# Altium project YUsendQB50.PrjPCB
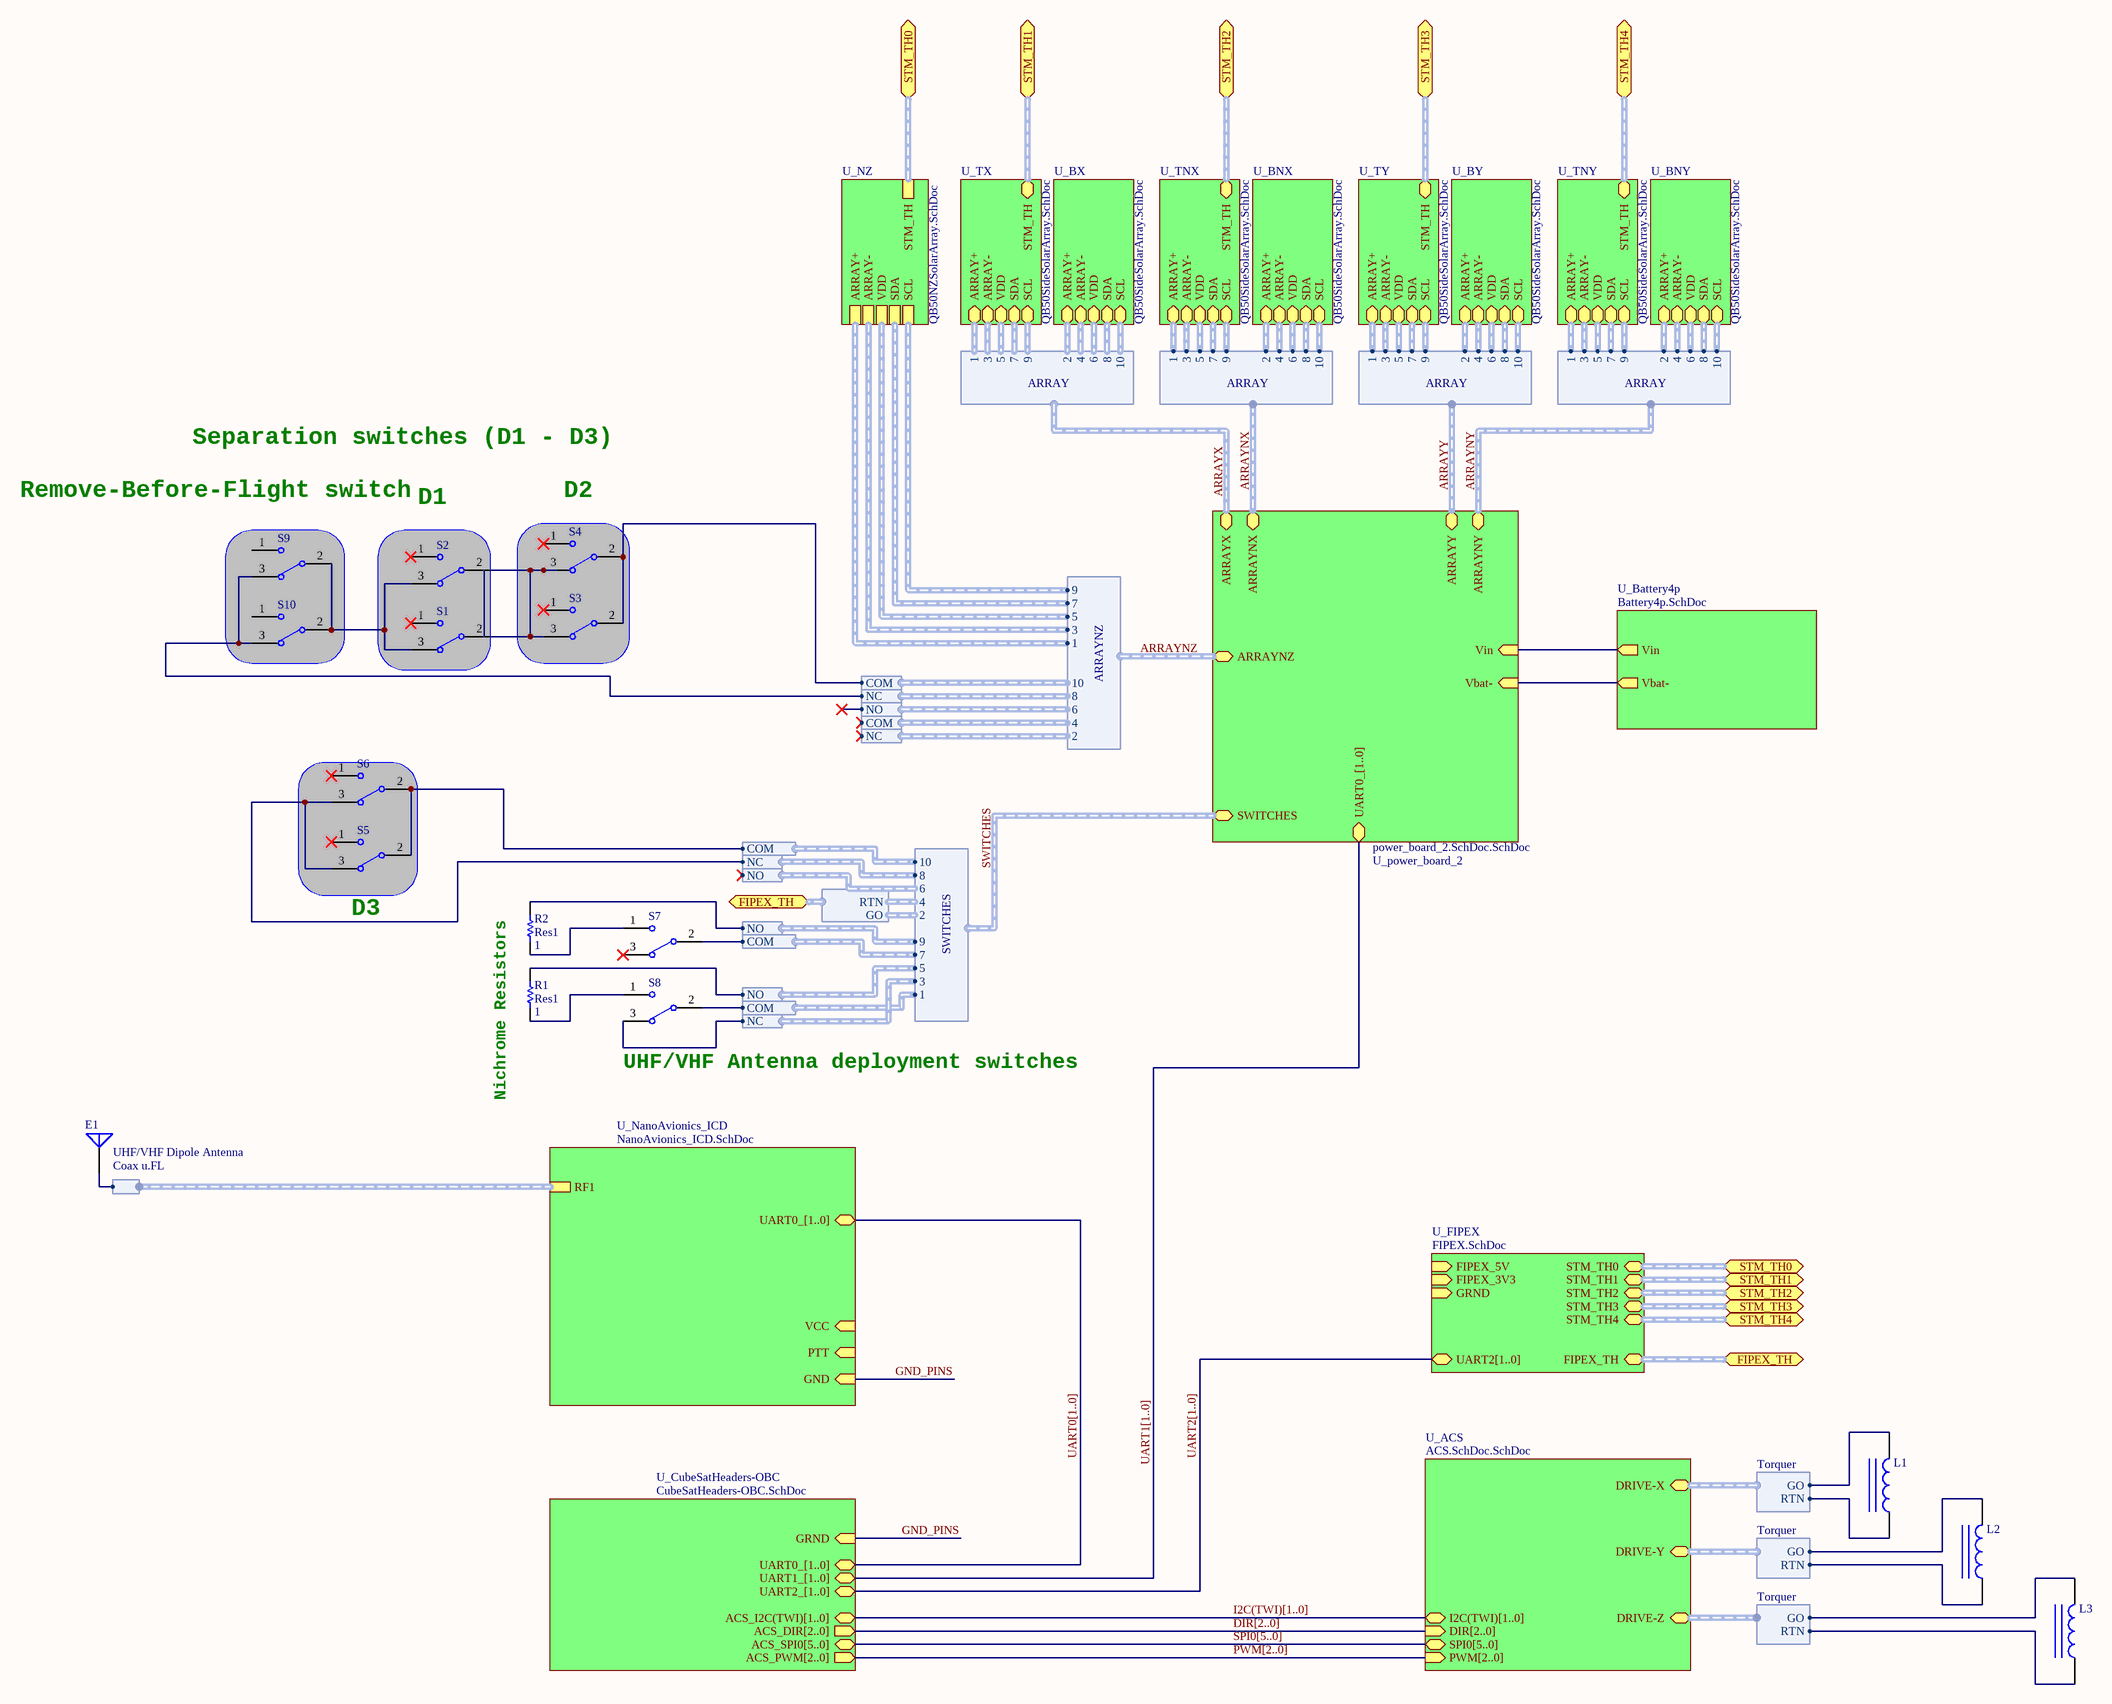
[diagram p0: YUsendQB50-TopLevel.SchDoc]
8 sheets, 320 parts. Net scope: hierarchical (ports join the sheet entries above them; power ports are global).
Sheets:
  YUsendQB50-TopLevel.SchDoc
    U_CubeSatHeaders-OBC = CubeSatHeaders-OBC.SchDoc
    U_power_board_2 = power_board_2.SchDoc.SchDoc
    U_ACS = ACS.SchDoc.SchDoc
    U_FIPEX = FIPEX.SchDoc
    U_TX = QB50SideSolarArray.SchDoc
    U_BX = QB50SideSolarArray.SchDoc
    U_TNX = QB50SideSolarArray.SchDoc
    U_BNX = QB50SideSolarArray.SchDoc
    U_TY = QB50SideSolarArray.SchDoc
    U_BY = QB50SideSolarArray.SchDoc
    U_TNY = QB50SideSolarArray.SchDoc
    U_BNY = QB50SideSolarArray.SchDoc
    U_NZ = QB50NZSolarArray.SchDoc
    U_NanoAvionics_ICD = NanoAvionics_ICD.SchDoc

## Sheet YUsendQB50-TopLevel.SchDoc: Top Level YUsend-QB50 (CA01)
size C; DrawnBy: H. Chesser

### Parts
(Parts that share a designator on the sheet are numbered #1, #2 ... from top to bottom, then left to right.)
E1  UHF/VHF Dipole Antenna  [PIN1]
L1#1  Inductor Iron  [AXIAL-0.9]  (value not drawn)
L2#1  Inductor Iron  [AXIAL-0.9]  (value not drawn)
L3#1  Inductor Iron  [AXIAL-0.9]  (value not drawn)
R1#1  Res1  value 1  [AXIAL-0.3]
R2#1  Res1  value 1  [AXIAL-0.3]
S1  SW-SPDT  [TL36WW15050]  (value not drawn)
S2  SW-SPDT  [TL36WW15050]  (value not drawn)
S3  SW-SPDT  [TL36WW15050]  (value not drawn)
S4  SW-SPDT  [TL36WW15050]  (value not drawn)
S5  SW-SPDT  [TL36WW15050]  (value not drawn)
S6  SW-SPDT  [TL36WW15050]  (value not drawn)
S7  SW-SPDT  [TL36WW15050]  (value not drawn)
S8  SW-SPDT  [TL36WW15050]  (value not drawn)
S9  SW-SPDT  [TL36WW15050]  (value not drawn)
S10  SW-SPDT  [TL36WW15050]  (value not drawn)

### Sub-sheets
U_ACS = ACS.SchDoc.SchDoc: I2C(TWI)[1..0] (bidir), PWM[2..0] (in), DRIVE-X (harness Torquer), DRIVE-Y (harness Torquer), DRIVE-Z (harness Torquer), DIR[2..0] (in), SPI0[5..0] (bidir)
U_Battery4p = Battery4p.SchDoc (file not in this document): Vbat- (out), Vin (out)
U_BNX = QB50SideSolarArray.SchDoc: ARRAY+ (harness ARRAY+), ARRAY- (harness ARRAY-), VDD (harness VDD), SDA (harness SDA), SCL (harness SCL)
U_BNY = QB50SideSolarArray.SchDoc: ARRAY+ (harness ARRAY+), ARRAY- (harness ARRAY-), VDD (harness VDD), SDA (harness SDA), SCL (harness SCL)
U_BX = QB50SideSolarArray.SchDoc: ARRAY+ (harness ARRAY+), ARRAY- (harness ARRAY-), VDD (harness VDD), SDA (harness SDA), SCL (harness SCL)
U_BY = QB50SideSolarArray.SchDoc: ARRAY+ (harness ARRAY+), ARRAY- (harness ARRAY-), VDD (harness VDD), SDA (harness SDA), SCL (harness SCL)
U_CubeSatHeaders-OBC = CubeSatHeaders-OBC.SchDoc: UART0_[1..0] (bidir), UART1_[1..0] (bidir), GRND (in), UART2_[1..0] (bidir), ACS_I2C(TWI)[1..0] (bidir), ACS_DIR[2..0] (out), ACS_PWM[2..0] (out), ACS_SPI0[5..0] (bidir)
U_FIPEX = FIPEX.SchDoc: UART2[1..0] (bidir), GRND (in), FIPEX_3V3 (in), FIPEX_5V (in), STM_TH0 (harness STM_TH), STM_TH2 (harness STM_TH), STM_TH3 (harness STM_TH), STM_TH4 (harness STM_TH), FIPEX_TH (harness STM_TH), STM_TH1 (harness STM_TH)
U_NanoAvionics_ICD = NanoAvionics_ICD.SchDoc: UART0_[1..0] (bidir), VCC (in), RF1 (harness Coax u.FL), PTT (in), GND (in)
U_NZ = QB50NZSolarArray.SchDoc: ARRAY+ (harness ARRAY+), ARRAY- (harness ARRAY-), VDD (harness VDD), SDA (harness SDA), SCL (harness SCL), STM_TH (harness STM_TH)
U_power_board_2 = power_board_2.SchDoc.SchDoc: UART0_[1..0] (bidir), ARRAYX (harness ARRAY), ARRAYNX (harness ARRAY), ARRAYY (harness ARRAY), ARRAYNY (harness ARRAY), ARRAYNZ (harness ARRAYNZ), SWITCHES (harness SWITCHES), Vin (in), Vbat- (in)
U_TNX = QB50SideSolarArray.SchDoc: ARRAY+ (harness ARRAY+), ARRAY- (harness ARRAY-), VDD (harness VDD), SDA (harness SDA), SCL (harness SCL), STM_TH (harness STM_TH)
U_TNY = QB50SideSolarArray.SchDoc: ARRAY+ (harness ARRAY+), ARRAY- (harness ARRAY-), VDD (harness VDD), SDA (harness SDA), SCL (harness SCL), STM_TH (harness STM_TH)
U_TX = QB50SideSolarArray.SchDoc: ARRAY+ (harness ARRAY+), ARRAY- (harness ARRAY-), VDD (harness VDD), SDA (harness SDA), SCL (harness SCL), STM_TH (harness STM_TH)
U_TY = QB50SideSolarArray.SchDoc: ARRAY+ (harness ARRAY+), ARRAY- (harness ARRAY-), VDD (harness VDD), SDA (harness SDA), SCL (harness SCL), STM_TH (harness STM_TH)

### Ports
FIPEX_TH, FIPEX_TH (harness STM_TH), STM_TH0, STM_TH1, STM_TH2, STM_TH3, STM_TH4

### Harnesses
ARRAY: 1, 3, 5, 7, 9, 2, 4, 6, 8, 10
ARRAY: 1, 10, 2, 3, 4, 5, 6, 7, 8, 9
ARRAYNZ: 1, 10, 2, 3, 4, 5, 6, 7, 8, 9
SEPCOM: COM
SEPNC: NC
COM: COM
NC: NC
NO: NO
SWITCHES: 1, 10, 2, 3, 4, 5, 6, 7, 8, 9
STM_TH: GO, RTN
Torquer: GO, RTN
Coax u.FL: 

### Nets
GND_PINS: R1#1.2 R2#1.2 ; sheet U_CubeSatHeaders-OBC/GRND, sheet U_NanoAvionics_ICD/GND, harness NO.NO  [project net Array-]
ARRAYNZ.8.NC.NC: S9.3 S10.3 ; sheet U_power_board_2/Vin, sheet U_Battery4p/Vin, harness SEPNC.NC
ARRAYNZ.10.COM.COM: S3.2 S4.2 ; harness SEPCOM.COM
DRIVE-XA: L1#1.2 ; sheet U_ACS/DRIVE-X.GO
DRIVE-XB: L1#1.1 ; sheet U_ACS/DRIVE-X.RTN
DRIVE-YA: L2#1.2 ; sheet U_ACS/DRIVE-Y.GO
DRIVE-YB: L2#1.1 ; sheet U_ACS/DRIVE-Y.RTN
DRIVE-ZA: L3#1.2 ; sheet U_ACS/DRIVE-Z.GO
DRIVE-ZB: L3#1.1 ; sheet U_ACS/DRIVE-Z.RTN
SWITCHES.1.COM.COM: S8.2 ; harness COM.COM
SWITCHES.3.NC.NC: S7.2 S8.3 ; harness COM.COM, harness NC.NC
SWITCHES.10.COM.COM: sheet U_power_board_2/Vbat-, sheet U_Battery4p/Vbat-
NetE1_1: E1.1(A) ; sheet U_NanoAvionics_ICD/RF1.
NetR1#1_1: R1#1.1 S8.1
NetR2#1_1: R2#1.1 S7.1
NetS1_2: S1.2 S2.2 S3.3 S4.3
NetS1_3: S1.3 S2.3 S9.2 S10.2
NetS5_2: S5.2 S6.2 ; harness COM.COM
NetS5_3: S5.3 S6.3 ; harness NC.NC

Not connected (* = marked no-connect by the designer): S1 1*; S2 1*; S3 1*; S4 1*; S5 1*; S6 1*; S7 3*; S9 1; S10 1

### Buses and harness runs
bus DIR[2..0] = sheet U_ACS/DIR[2..0] = sheet U_CubeSatHeaders-OBC/ACS_DIR[2..0]
bus I2C(TWI)[1..0] = sheet U_ACS/I2C(TWI)[1..0] = sheet U_CubeSatHeaders-OBC/ACS_I2C(TWI)[1..0]
bus PWM[2..0] = sheet U_ACS/PWM[2..0] = sheet U_CubeSatHeaders-OBC/ACS_PWM[2..0]
bus SPI0[5..0] = sheet U_ACS/SPI0[5..0] = sheet U_CubeSatHeaders-OBC/ACS_SPI0[5..0]
bus UART0[1..0] = sheet U_CubeSatHeaders-OBC/UART0_[1..0] = sheet U_NanoAvionics_ICD/UART0_[1..0]
bus UART1[1..0] = sheet U_CubeSatHeaders-OBC/UART1_[1..0] = sheet U_power_board_2/UART0_[1..0]
bus UART2[1..0] = sheet U_CubeSatHeaders-OBC/UART2_[1..0] = sheet U_FIPEX/UART2[1..0]
harness ARRAYNX = sheet U_power_board_2/ARRAYNX
harness ARRAYNY = sheet U_power_board_2/ARRAYNY
harness ARRAYNZ = sheet U_power_board_2/ARRAYNZ
harness ARRAYX = sheet U_power_board_2/ARRAYX
harness ARRAYY = sheet U_power_board_2/ARRAYY
harness port FIPEX_TH = sheet U_FIPEX/FIPEX_TH
harness port STM_TH0 = sheet U_FIPEX/STM_TH0
harness port STM_TH0 = sheet U_NZ/STM_TH
harness port STM_TH1 = sheet U_FIPEX/STM_TH1
harness port STM_TH1 = sheet U_TX/STM_TH
harness port STM_TH2 = sheet U_FIPEX/STM_TH2
harness port STM_TH2 = sheet U_TNX/STM_TH
harness port STM_TH3 = sheet U_FIPEX/STM_TH3
harness port STM_TH3 = sheet U_TY/STM_TH
harness port STM_TH4 = sheet U_FIPEX/STM_TH4
harness port STM_TH4 = sheet U_TNY/STM_TH
harness SWITCHES = sheet U_power_board_2/SWITCHES

### Notes on the sheet
- Separation switches (D1 - D3)
- (near S9) Remove-Before-Flight switch
- (near S2) D1
- (near S4) D2
- (near S5) D3
- Nichrome Resistors
- (near S8) UHF/VHF Antenna deployment switches

### Library data of the parts
E1 = Antenna: Generic Antenna; Published: 24-Mar-1999; LatestRevisionDate: 17-Jul-2002; LatestRevisionNote: Re-released for DXP Platform.; PackageReference: PIN1; Publisher: Altium Limited
L1#1 L2#1 L3#1 = Inductor Iron: Magnetic-Core Inductor; Value: 10mH; Published: 24-Mar-1999; LatestRevisionDate: 17-Jul-2002; LatestRevisionNote: Re-released for DXP Platform.; PackageReference: AXIAL-0.9; Publisher: Altium Limited; PackageDescription: Axial Device, Thru-Hole; 2 Leads; 0.9 in Pin Spacing
R1#1 R2#1 = Res1: Resistor; Published: 8-Jun-2000; LatestRevisionDate: 17-Jul-2002; LatestRevisionNote: Re-released for DXP Platform.; PackageReference: AXIAL-0.3; Publisher: Altium Limited; PackageDescription: Axial Device, Thru-Hole; 2 Leads; 0.3 in Pin Spacing
S1-S10 = SW-SPDT: SPDT Subminiature Toggle Switch, Right Angle Mounting, Vertical Actuation; Published: 24-Mar-1999; LatestRevisionDate: 17-Dec-2003; LatestRevisionNote: Schematic revised, PCB Footprint replaced.; DatasheetVersion: 05-Dec-2000; PackageReference: TL36WW15050; Publisher: Altium Limited; PackageDescription: Switch; 4 Leads; ComponentLink1Description: Manufacturer Link; ComponentLink1URL: http://www.apem.com; Supplier 1: Digi-Key; Supplier Part Number 1: 255-3400-ND

## Sheet CubeSatHeaders-OBC.SchDoc
size A4
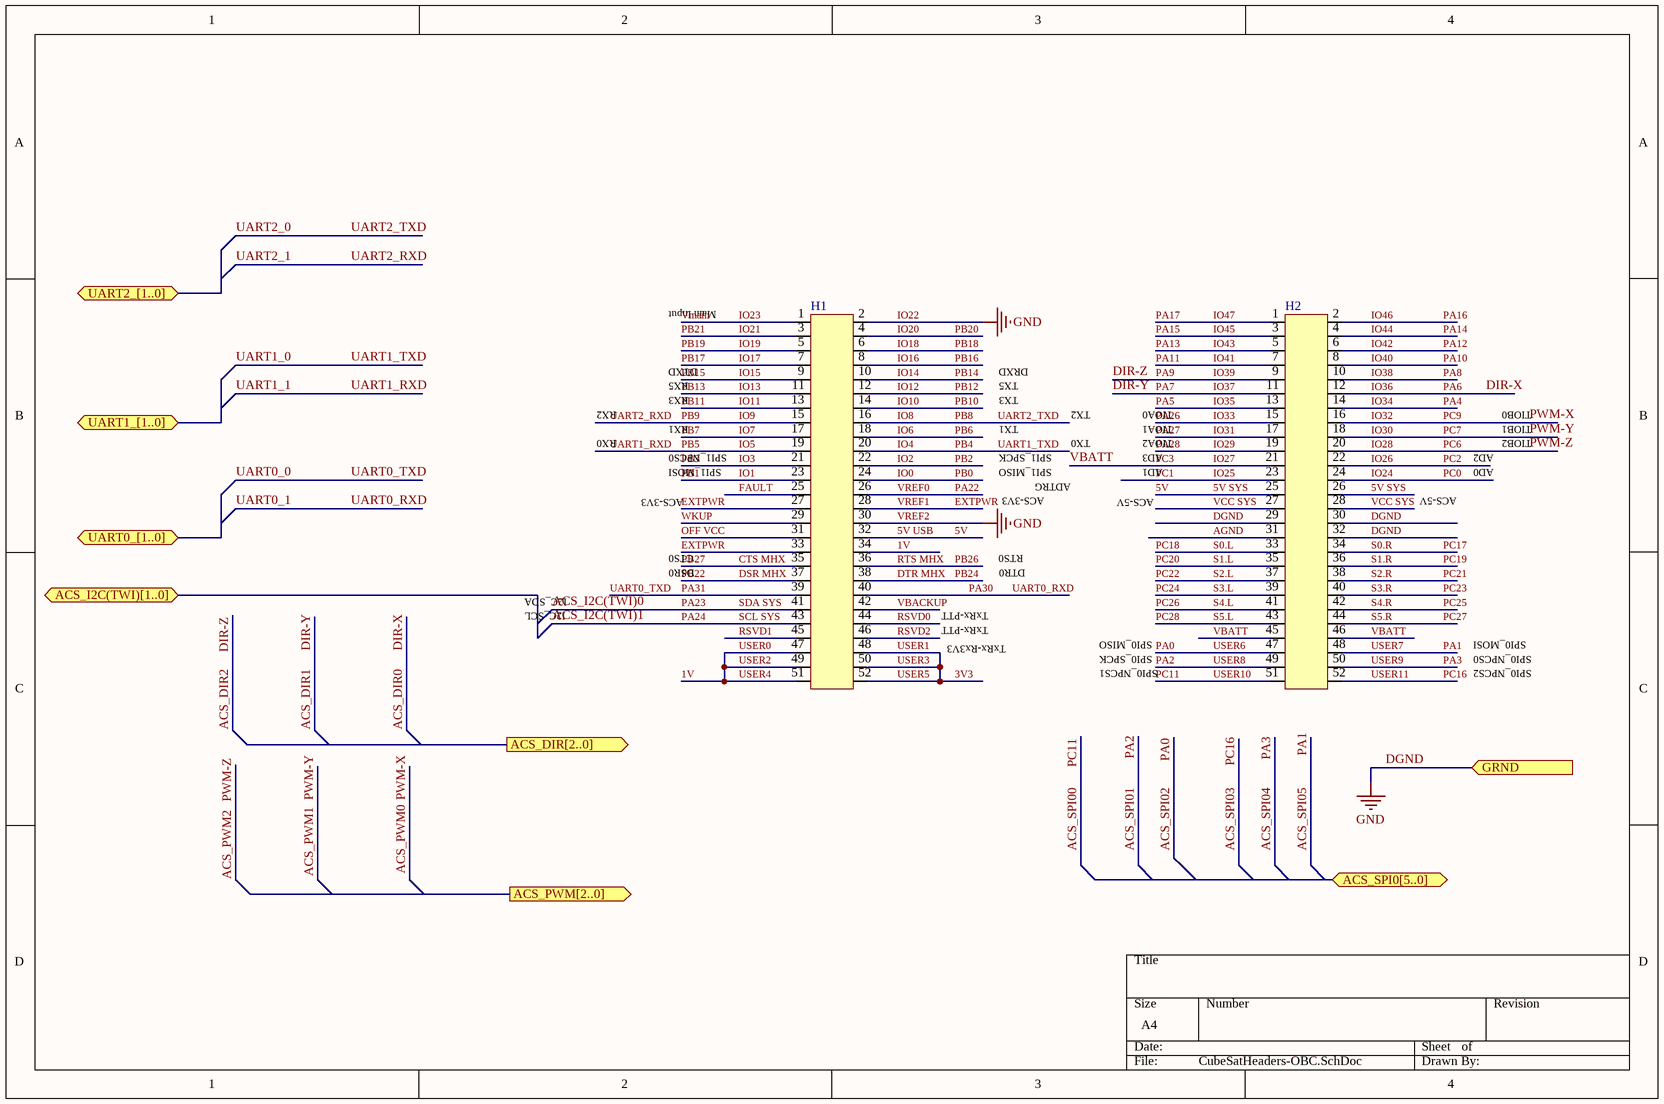
[diagram p1: CubeSatHeaders-OBC.SchDoc]

### Parts
(Parts that share a designator on the sheet are numbered #1, #2 ... from top to bottom, then left to right.)
H1#1  H?  [SAMTEC_ESQ_126_39_G_D]  (value not drawn)
H2#1  H?  [SAMTEC_ESQ_126_39_G_D]  (value not drawn)

### Ports
ACS_DIR[2..0] (out), ACS_I2C(TWI)[1..0] (bidir), ACS_PWM[2..0] (out), ACS_SPI0[5..0] (bidir), GRND (in), UART0_[1..0] (bidir), UART1_[1..0] (bidir), UART2_[1..0] (bidir)

### Nets
DGND: H1#1.2 H1#1.30 H2#1.29 H2#1.30 H2#1.32 ; port GRND  [also labelled GND, IO22, VREF2]  [project net Array-]
1V: H1#1.34 H1#1.47 H1#1.49 H1#1.51  [also labelled USER0, USER2, USER4]
3V3: H1#1.48 H1#1.50 H1#1.52  [also labelled USER1, USER3, USER5]
5V: H1#1.32 H2#1.25 H2#1.26  [also labelled 5V SYS, 5V USB]
ACS_DIR0: H2#1.12  [also labelled DIR-X, IO36, PA6]
ACS_DIR1: H2#1.11  [also labelled DIR-Y, IO37, PA7]
ACS_DIR2: H2#1.9  [also labelled DIR-Z, IO39, PA9]
ACS_I2C(TWI)0: H1#1.41  [also labelled PA23, SDA SYS]
ACS_I2C(TWI)1: H1#1.43  [also labelled PA24, SCL SYS]
ACS_PWM0: H2#1.16  [also labelled IO32, PC9, PWM-X]
ACS_PWM1: H2#1.18  [also labelled IO30, PC7, PWM-Y]
ACS_PWM2: H2#1.20  [also labelled IO28, PC6, PWM-Z]
ACS_SPI00: H2#1.51  [also labelled PC11, USER10]
ACS_SPI01: H2#1.49  [also labelled PA2, USER8]
ACS_SPI02: H2#1.47  [also labelled PA0, USER6]
ACS_SPI03: H2#1.52  [also labelled PC16, USER11]
ACS_SPI04: H2#1.50  [also labelled PA3, USER9]
ACS_SPI05: H2#1.48  [also labelled PA1, USER7]
AGND: H2#1.31
CTS MHX: H1#1.35  [also labelled PB27]
DSR MHX: H1#1.37  [also labelled PB22]
DTR MHX: H1#1.38  [also labelled PB24]
EXTPWR: H1#1.27 H1#1.28 H1#1.33  [also labelled VREF1]
FAULT: H1#1.25
IO0: H1#1.24  [also labelled PB0]
IO1: H1#1.23  [also labelled PB1]
IO2: H1#1.22  [also labelled PB2]
IO3: H1#1.21  [also labelled PB3]
IO4: H1#1.20  [also labelled PB4, UART1_0, UART1_TXD]
IO5: H1#1.19  [also labelled PB5, UART1_1, UART1_RXD]
IO6: H1#1.18  [also labelled PB6]
IO7: H1#1.17  [also labelled PB7]
IO8: H1#1.16  [also labelled PB8, UART2_0, UART2_TXD]
IO9: H1#1.15  [also labelled PB9, UART2_1, UART2_RXD]
IO10: H1#1.14  [also labelled PB10]
IO11: H1#1.13  [also labelled PB11]
IO12: H1#1.12  [also labelled PB12]
IO13: H1#1.11  [also labelled PB13]
IO14: H1#1.10  [also labelled PB14]
IO15: H1#1.9  [also labelled PB15]
IO16: H1#1.8  [also labelled PB16]
IO17: H1#1.7  [also labelled PB17]
IO18: H1#1.6  [also labelled PB18]
IO19: H1#1.5  [also labelled PB19]
IO20: H1#1.4  [also labelled PB20]
IO21: H1#1.3  [also labelled PB21]
IO23: H1#1.1  [also labelled Vmain]
IO24: H2#1.24  [also labelled PC0]
IO25: H2#1.23  [also labelled PC1]
IO26: H2#1.22  [also labelled PC2]
IO27: H2#1.21 H2#1.45 H2#1.46  [also labelled PC3, VBATT]
IO29: H2#1.19  [also labelled PA28]
IO31: H2#1.17  [also labelled PA27]
IO33: H2#1.15  [also labelled PA26]
IO34: H2#1.14  [also labelled PA4]
IO35: H2#1.13  [also labelled PA5]
IO38: H2#1.10  [also labelled PA8]
IO40: H2#1.8  [also labelled PA10]
IO41: H2#1.7  [also labelled PA11]
IO42: H2#1.6  [also labelled PA12]
IO43: H2#1.5  [also labelled PA13]
IO44: H2#1.4  [also labelled PA14]
IO45: H2#1.3  [also labelled PA15]
IO46: H2#1.2  [also labelled PA16]
IO47: H2#1.1  [also labelled PA17]
OFF VCC: H1#1.31
PA22: H1#1.26  [also labelled VREF0]
PA30: H1#1.40  [also labelled UART0_1, UART0_RXD]
PA31: H1#1.39  [also labelled UART0_0, UART0_TXD]
PB26: H1#1.36  [also labelled RTS MHX]
PC17: H2#1.34  [also labelled S0.R]
PC18: H2#1.33  [also labelled S0.L]
PC19: H2#1.36  [also labelled S1.R]
PC20: H2#1.35  [also labelled S1.L]
PC21: H2#1.38  [also labelled S2.R]
PC22: H2#1.37  [also labelled S2.L]
PC23: H2#1.40  [also labelled S3.R]
PC24: H2#1.39  [also labelled S3.L]
PC25: H2#1.42  [also labelled S4.R]
PC26: H2#1.41  [also labelled S4.L]
PC27: H2#1.44  [also labelled S5.R]
PC28: H2#1.43  [also labelled S5.L]
RSVD0: H1#1.44
RSVD1: H1#1.45
RSVD2: H1#1.46
VBACKUP: H1#1.42
VCC SYS: H2#1.27 H2#1.28
WKUP: H1#1.29

### Notes on the sheet
- Main Input
- RX3
- RX5
- DTXD
- TX3
- TX5
- DRXD
- RX0
- RX2
- RX1
- SPI1_NPCS0
- SPI1_MOSI
- TX1
- SPI1_SPCK
- SPI1_MISO
- TX0
- TX2
- AD1
- AD3
- TIOA0
- TIOA1
- TIOA2
- AD0
- AD2
- TIOB0
- TIOB1
- TIOB2
- ACS-3V3
- ADTRG
- ACS-5V
- I2C_SDA
- I2C_SCL
- CTS0
- DSR0
- TxRx-PTT
- DTR0
- RTS0
- TxRx-Rx3V3
- SPI0_MISO
- SPI0_SPCK
- SPI0_NPCS1
- SPI0_MOSI
- SPI0_NPCS0
- SPI0_NPCS2

### Library data of the parts
H1#1 H2#1 = SAMTEC_ESQ_126_39_G_D: 26X2 header

## Sheet power_board_2.SchDoc.SchDoc
size C
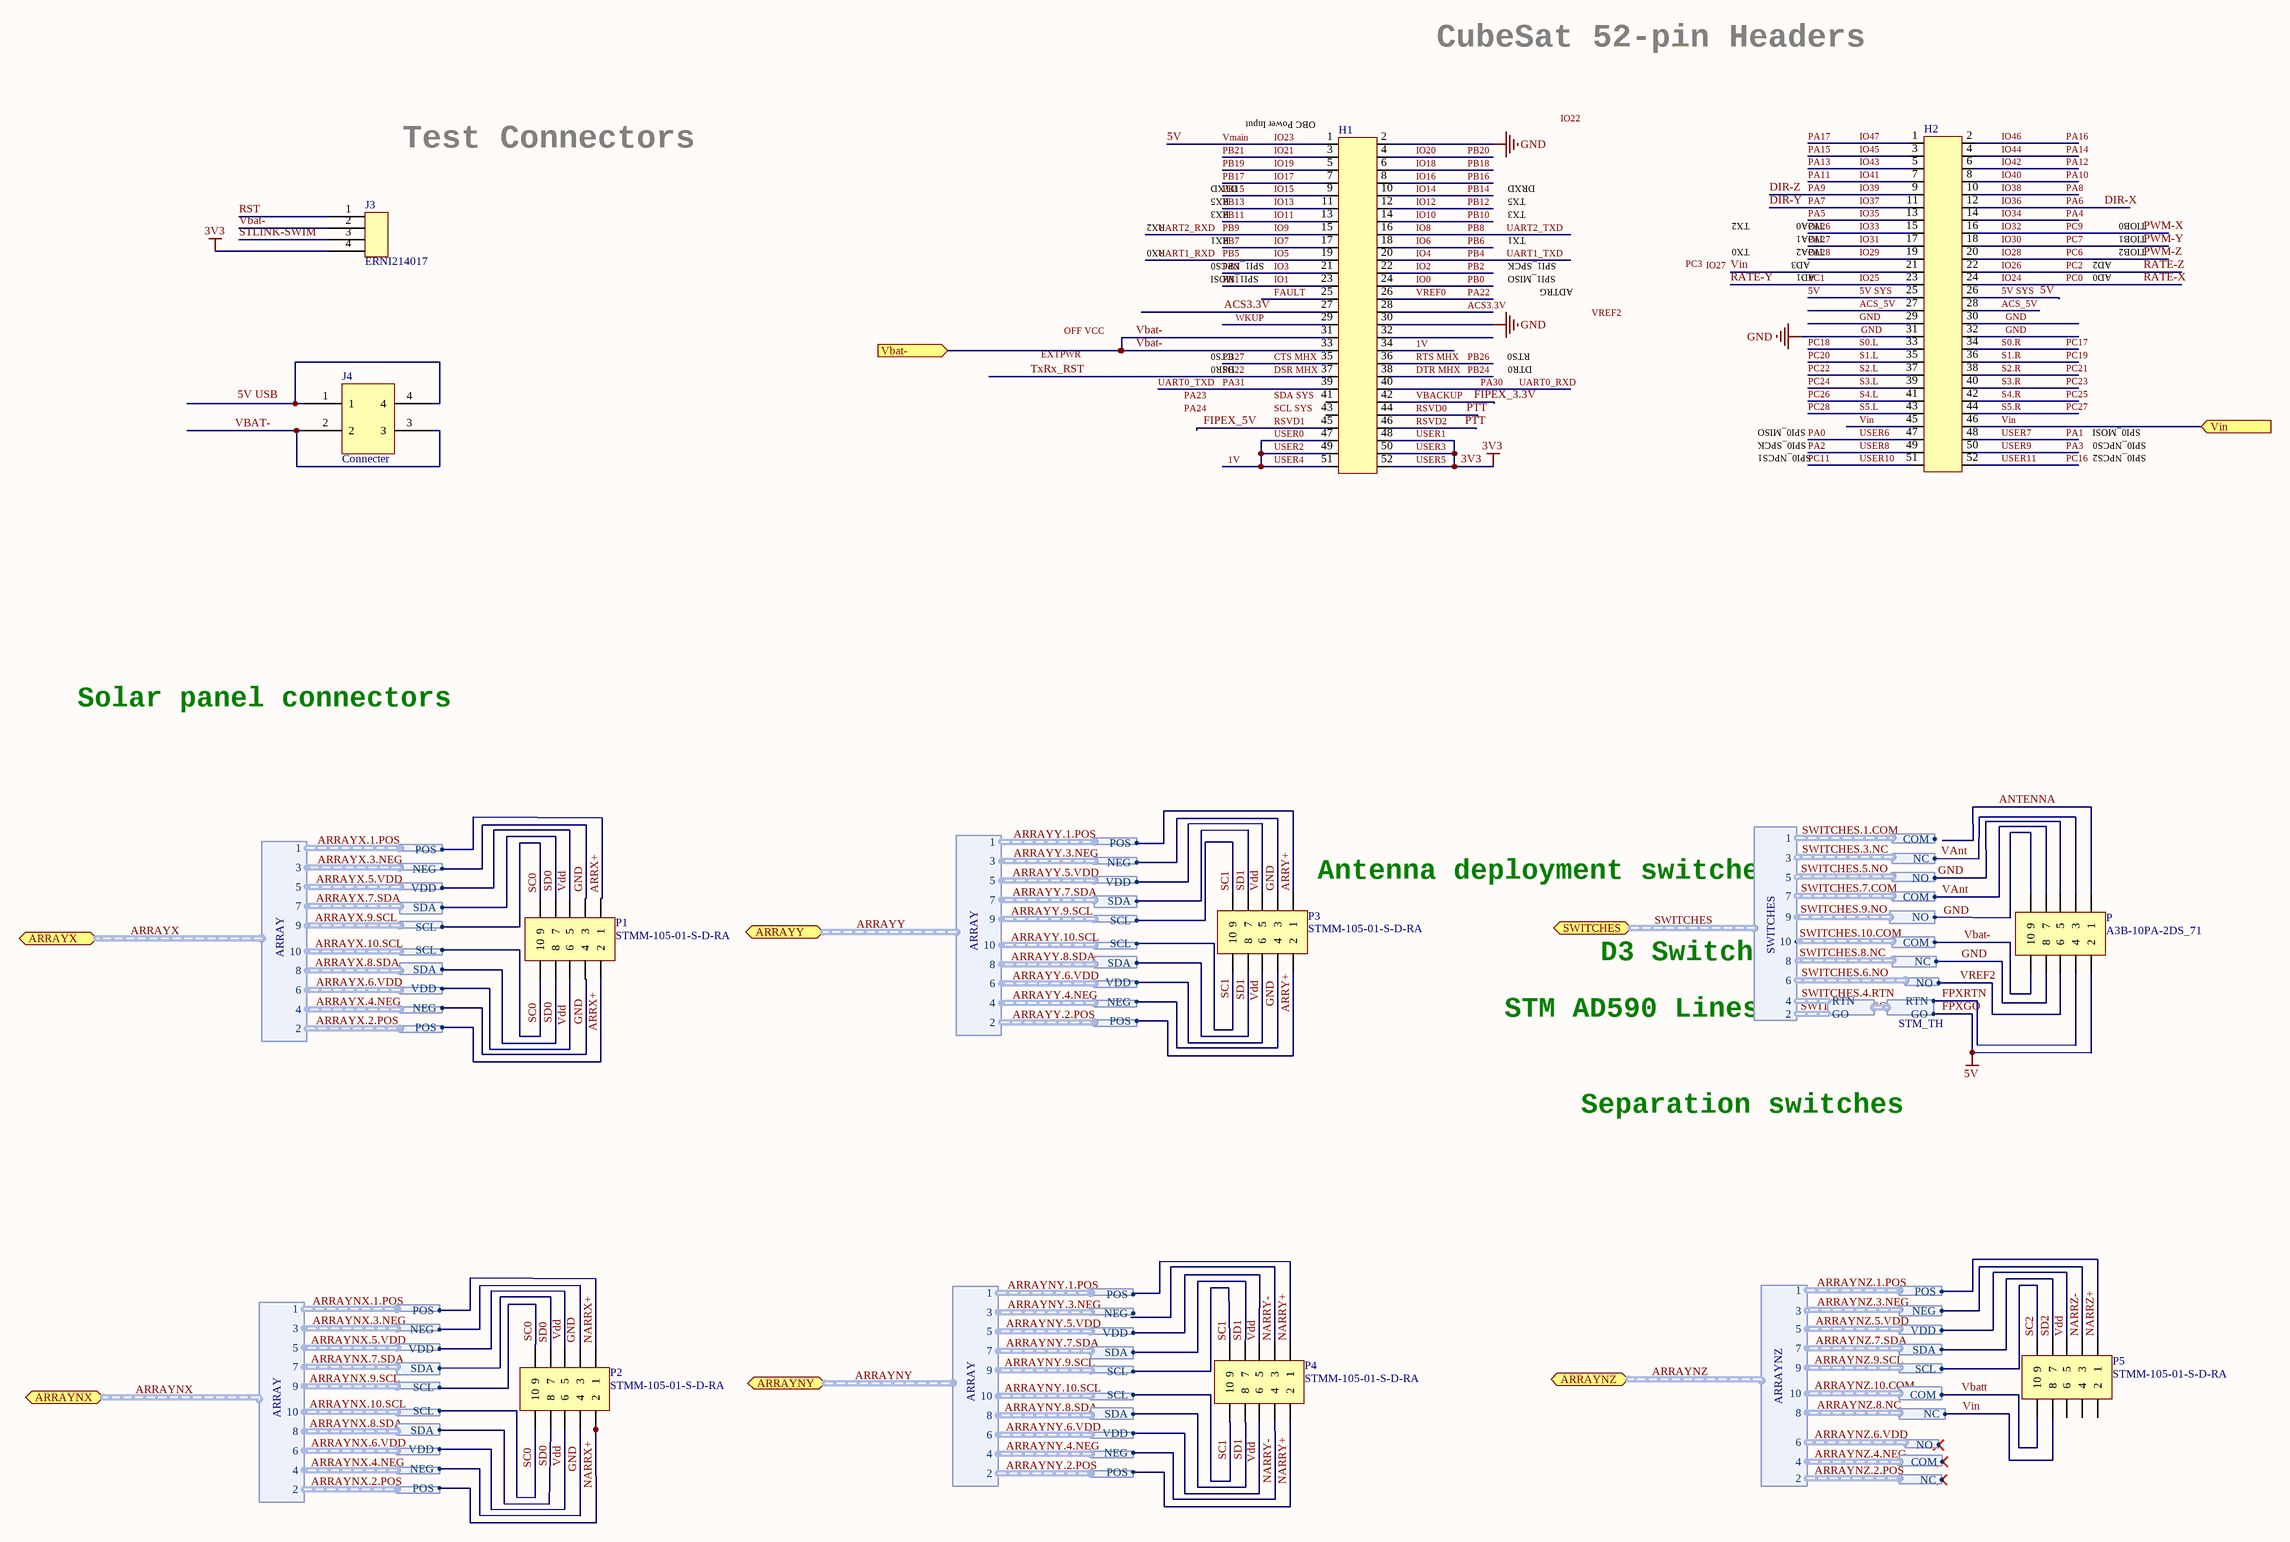
[diagram p2: power_board_2.SchDoc.SchDoc]

### Parts
(Parts that share a designator on the sheet are numbered #1, #2 ... from top to bottom, then left to right.)
H1#2  H?  [SAMTEC_ESQ_126_39_G_D]  (value not drawn)
H2#2  H?  [SAMTEC_ESQ_126_39_G_D]  (value not drawn)
J3#1  ERNI214017  [ERNI2014017]
J4  Connecter  [Connecter]
P  A3B-10PA-2DS_71  [A3B-10PA-2DS_71]
P1  STMM-105-01-S-D-RA  [STMM-105-01-S-D-RA]
P2  STMM-105-01-S-D-RA  [STMM-105-01-S-D-RA]
P3  STMM-105-01-S-D-RA  [STMM-105-01-S-D-RA]
P4  STMM-105-01-S-D-RA  [STMM-105-01-S-D-RA]
P5  STMM-105-01-S-D-RA  [STMM-105-01-S-D-RA]

### Ports
ARRAYNX (harness ARRAY), ARRAYNY (harness ARRAY), ARRAYNZ (harness ARRAYNZ), ARRAYX (harness ARRAY), ARRAYY (harness ARRAY), SWITCHES (harness SWITCHES), Vbat- (in), Vin (in)

### Harnesses
ARRAY: 1, 10, 2, 3, 4, 5, 6, 7, 8, 9
ARRAY+: POS
ARRAY-: NEG
VDD: VDD
SDA: SDA
SCL: SCL
SEPCOM: COM
SEPNC: NC
COM: COM
NC: NC
NO: NO
SWITCHES: 10, 8, 6, 4, 2, 9, 7, 5, 3, 1
STM_TH: RTN, GO
ARRAYNZ: 10, 8, 6, 4, 2, 9, 7, 5, 3, 1

### Nets
3V3: H1#2.48 H1#2.50 H1#2.52 J3#1.4(RST)  [also labelled USER1, USER3, USER5]
5V: H1#2.1 H2#2.25 H2#2.26 P.2 ; harness STM_TH.GO  [also labelled 5V SYS, FPXGO, IO23, Vmain]
GND: H1#2.2 H1#2.30 H2#2.29 H2#2.30 H2#2.31 H2#2.32 P.5 P.8 P.9 P1.3 P1.4 P2.4 P3.3 P3.4 ; harness ARRAY-.NEG, harness NO.NO, harness SEPNC.NC  [project net Array-]
1V: H1#2.34 H1#2.47 H1#2.49 H1#2.51  [also labelled USER0, USER2, USER4]
ACS3.3V: H1#2.27 H1#2.28
ACS_5V: H2#2.27 H2#2.28
ANTENNA: P.1
Array-: P2.3 ; harness ARRAY-.NEG
ARRAYNX.8.SDA.SDA: P2.8 ; harness SDA.SDA
ARRX+: P1.1 P1.2 ; harness ARRAY+.POS  [project net Array+]
ARRY+: P3.1 P3.2 ; harness ARRAY+.POS  [project net Array+]
CTS MHX: H1#2.35  [also labelled PB27]
DIR-X: H2#2.12  [also labelled IO36, PA6]
DIR-Y: H2#2.11  [also labelled IO37, PA7]
DIR-Z: H2#2.9  [also labelled IO39, PA9]
DSR MHX: H1#2.37  [also labelled PB22, TxRx_RST]
DTR MHX: H1#2.38  [also labelled PB24]
FAULT: H1#2.25
FIPEX_3.3V: H1#2.42  [also labelled VBACKUP]
FIPEX_5V: H1#2.45  [also labelled RSVD1]
FPXRTN: P.4 ; harness STM_TH.RTN  [project net FIPEX_TH_RET]
IO0: H1#2.24  [also labelled PB0]
IO1: H1#2.23  [also labelled PB1]
IO2: H1#2.22  [also labelled PB2]
IO3: H1#2.21  [also labelled PB3]
IO4: H1#2.20  [also labelled PB4, UART1_TXD]
IO5: H1#2.19  [also labelled PB5, UART1_RXD]
IO6: H1#2.18  [also labelled PB6]
IO7: H1#2.17  [also labelled PB7]
IO8: H1#2.16  [also labelled PB8, UART2_TXD]
IO9: H1#2.15  [also labelled PB9, UART2_RXD]
IO10: H1#2.14  [also labelled PB10]
IO11: H1#2.13  [also labelled PB11]
IO12: H1#2.12  [also labelled PB12]
IO13: H1#2.11  [also labelled PB13]
IO14: H1#2.10  [also labelled PB14]
IO15: H1#2.9  [also labelled PB15]
IO16: H1#2.8  [also labelled PB16]
IO17: H1#2.7  [also labelled PB17]
IO18: H1#2.6  [also labelled PB18]
IO19: H1#2.5  [also labelled PB19]
IO20: H1#2.4  [also labelled PB20]
IO21: H1#2.3  [also labelled PB21]
IO24: H2#2.24  [also labelled PC0, RATE-X]
IO25: H2#2.23  [also labelled PC1, RATE-Y]
IO26: H2#2.22  [also labelled PC2, RATE-Z]
IO28: H2#2.20  [also labelled PC6, PWM-Z]
IO29: H2#2.19  [also labelled PA28]
IO30: H2#2.18  [also labelled PC7, PWM-Y]
IO31: H2#2.17  [also labelled PA27]
IO32: H2#2.16  [also labelled PC9, PWM-X]
IO33: H2#2.15  [also labelled PA26]
IO34: H2#2.14  [also labelled PA4]
IO35: H2#2.13  [also labelled PA5]
IO38: H2#2.10  [also labelled PA8]
IO40: H2#2.8  [also labelled PA10]
IO41: H2#2.7  [also labelled PA11]
IO42: H2#2.6  [also labelled PA12]
IO43: H2#2.5  [also labelled PA13]
IO44: H2#2.4  [also labelled PA14]
IO45: H2#2.3  [also labelled PA15]
IO46: H2#2.2  [also labelled PA16]
IO47: H2#2.1  [also labelled PA17]
NARRX+: P2.1 P2.2 ; harness ARRAY+.POS  [project net Array+]
NARRY+: P4.1 P4.2 ; harness ARRAY+.POS  [project net Array+]
NARRY-: P4.3 P4.4 ; harness ARRAY-.NEG  [project net Array-]
NARRZ+: P5.1 ; harness ARRAY+.POS  [project net Array+]
NARRZ-: P5.3 ; harness ARRAY-.NEG  [project net Array-]
PA0: H2#2.47  [also labelled USER6]
PA1: H2#2.48  [also labelled USER7]
PA2: H2#2.49  [also labelled USER8]
PA3: H2#2.50  [also labelled USER9]
PA22: H1#2.26  [also labelled VREF0]
PA30: H1#2.40  [also labelled UART0_RXD]
PA31: H1#2.39  [also labelled UART0_TXD]
PB26: H1#2.36  [also labelled RTS MHX]
PC11: H2#2.51  [also labelled USER10]
PC16: H2#2.52  [also labelled USER11]
PC17: H2#2.34  [also labelled S0.R]
PC18: H2#2.33  [also labelled S0.L]
PC19: H2#2.36  [also labelled S1.R]
PC20: H2#2.35  [also labelled S1.L]
PC21: H2#2.38  [also labelled S2.R]
PC22: H2#2.37  [also labelled S2.L]
PC23: H2#2.40  [also labelled S3.R]
PC24: H2#2.39  [also labelled S3.L]
PC25: H2#2.42  [also labelled S4.R]
PC26: H2#2.41  [also labelled S4.L]
PC27: H2#2.44  [also labelled S5.R]
PC28: H2#2.43  [also labelled S5.L]
PTT: H1#2.44 H1#2.46  [also labelled RSVD0, RSVD2]
RST: J3#1.1(VCC)
SC0: P1.9 P1.10 P2.9 P2.10 ; harness SCL.SCL  [project net ARRAYNX.10.SCL.SCL]
SC1: P3.9 P3.10 P4.9 P4.10 ; harness SCL.SCL  [project net ARRAYNY.10.SCL.SCL]
SC2: P5.9 ; harness SCL.SCL  [project net ARRAYNZ.9.SCL.SCL]
SD0: P1.7 P1.8 P2.7 ; harness SDA.SDA  [project net ARRAYNX.7.SDA.SDA]
SD1: P3.7 P3.8 P4.7 P4.8 ; harness SDA.SDA  [project net ARRAYNY.7.SDA.SDA]
SD2: P5.7 ; harness SDA.SDA  [project net ARRAYNZ.7.SDA.SDA]
STLINK-SWIM: J3#1.3(GND)
VAnt: P.3 P.7 ; harness NC.NC, harness COM.COM  [project net SWITCHES.3.NC.NC]
Vbat-: H1#2.31 H1#2.33 J3#1.2(DATA) J4.2 J4.3 P.10 ; port Vbat-, harness SEPCOM.COM  [project net SWITCHES.10.COM.COM]
Vbatt: P5.10 ; harness SEPCOM.COM  [project net ARRAYNZ.10.COM.COM]
Vdd: P1.5 P1.6 P2.5 P2.6 P3.5 P3.6 P4.5 P4.6 P5.5 ; harness VDD.VDD  [project net ARRAYNX.5.VDD.VDD]
Vin: H2#2.21 H2#2.45 H2#2.46 P5.8 ; port Vin, harness SEPNC.NC  [project net ARRAYNZ.8.NC.NC]
VREF2: P.6 ; harness NO.NO  [project net SWITCHES.6.NO.NO]
WKUP: H1#2.29
NetJ4_1: J4.1 J4.4

Not connected (* = marked no-connect by the designer): H1#2 32 41 43; P5 2 4 6

### Buses and harness runs
harness ARRAYNX = port ARRAYNX
harness ARRAYNY = port ARRAYNY
harness ARRAYNZ = port ARRAYNZ
harness ARRAYX = port ARRAYX
harness ARRAYY = port ARRAYY
harness SWITCHES = port SWITCHES

### Notes on the sheet
- CubeSat 52-pin Headers
- Test Connectors
- OBC Power Input
- RX2
- RX3
- RX5
- DTXD
- TX3
- TX5
- DRXD
- TX2
- TIOA0
- TIOB0
- RX0
- RX1
- SPI1_NPCS0
- SPI1_MOSI
- TX1
- SPI1_SPCK
- SPI1_MISO
- ADTRG
- TX0
- AD3
- AD1
- TIOA1
- TIOA2
- AD0
- AD2
- TIOB1
- TIOB2
- CTS0
- RTS0
- DSR0
- DTR0
- SPI0_MISO
- SPI0_SPCK
- SPI0_NPCS1
- SPI0_MOSI
- SPI0_NPCS0
- SPI0_NPCS2
- Solar panel connectors
- (near P3) Antenna deployment switches
- D3 Switch
- STM AD590 Lines
- Separation switches
- Labels drawn without touching a wire or pin: 5V USB, EXTPWR, GND, IO22, IO27, OFF VCC, PA23, PA24, PC3, SCL SYS, SD0, SDA SYS, VREF2

### Library data of the parts
H1#2 H2#2 = SAMTEC_ESQ_126_39_G_D: 26X2 header
J3#1 = ERNI214017: Supplier 1: Mouser; Supplier Part Number 1: 305-214017
J4 = Connecter: Supplier 1: Digi-Key; Supplier Part Number 1: SAM1006-02-ND

## Sheet ACS.SchDoc.SchDoc: ACS Board for YUsend-QB50
size C; Date: 2014-07-29 11:58:47 AM; DrawnBy: Mark A. Post, H. Chesser; Revision: 2; SheetNumber: 1; A: A; B: B; C: C; E: E; F: F; H: H; 1: 1; 2: 2; 3: 3; 4: 4; 5: 5; Version:: Version:
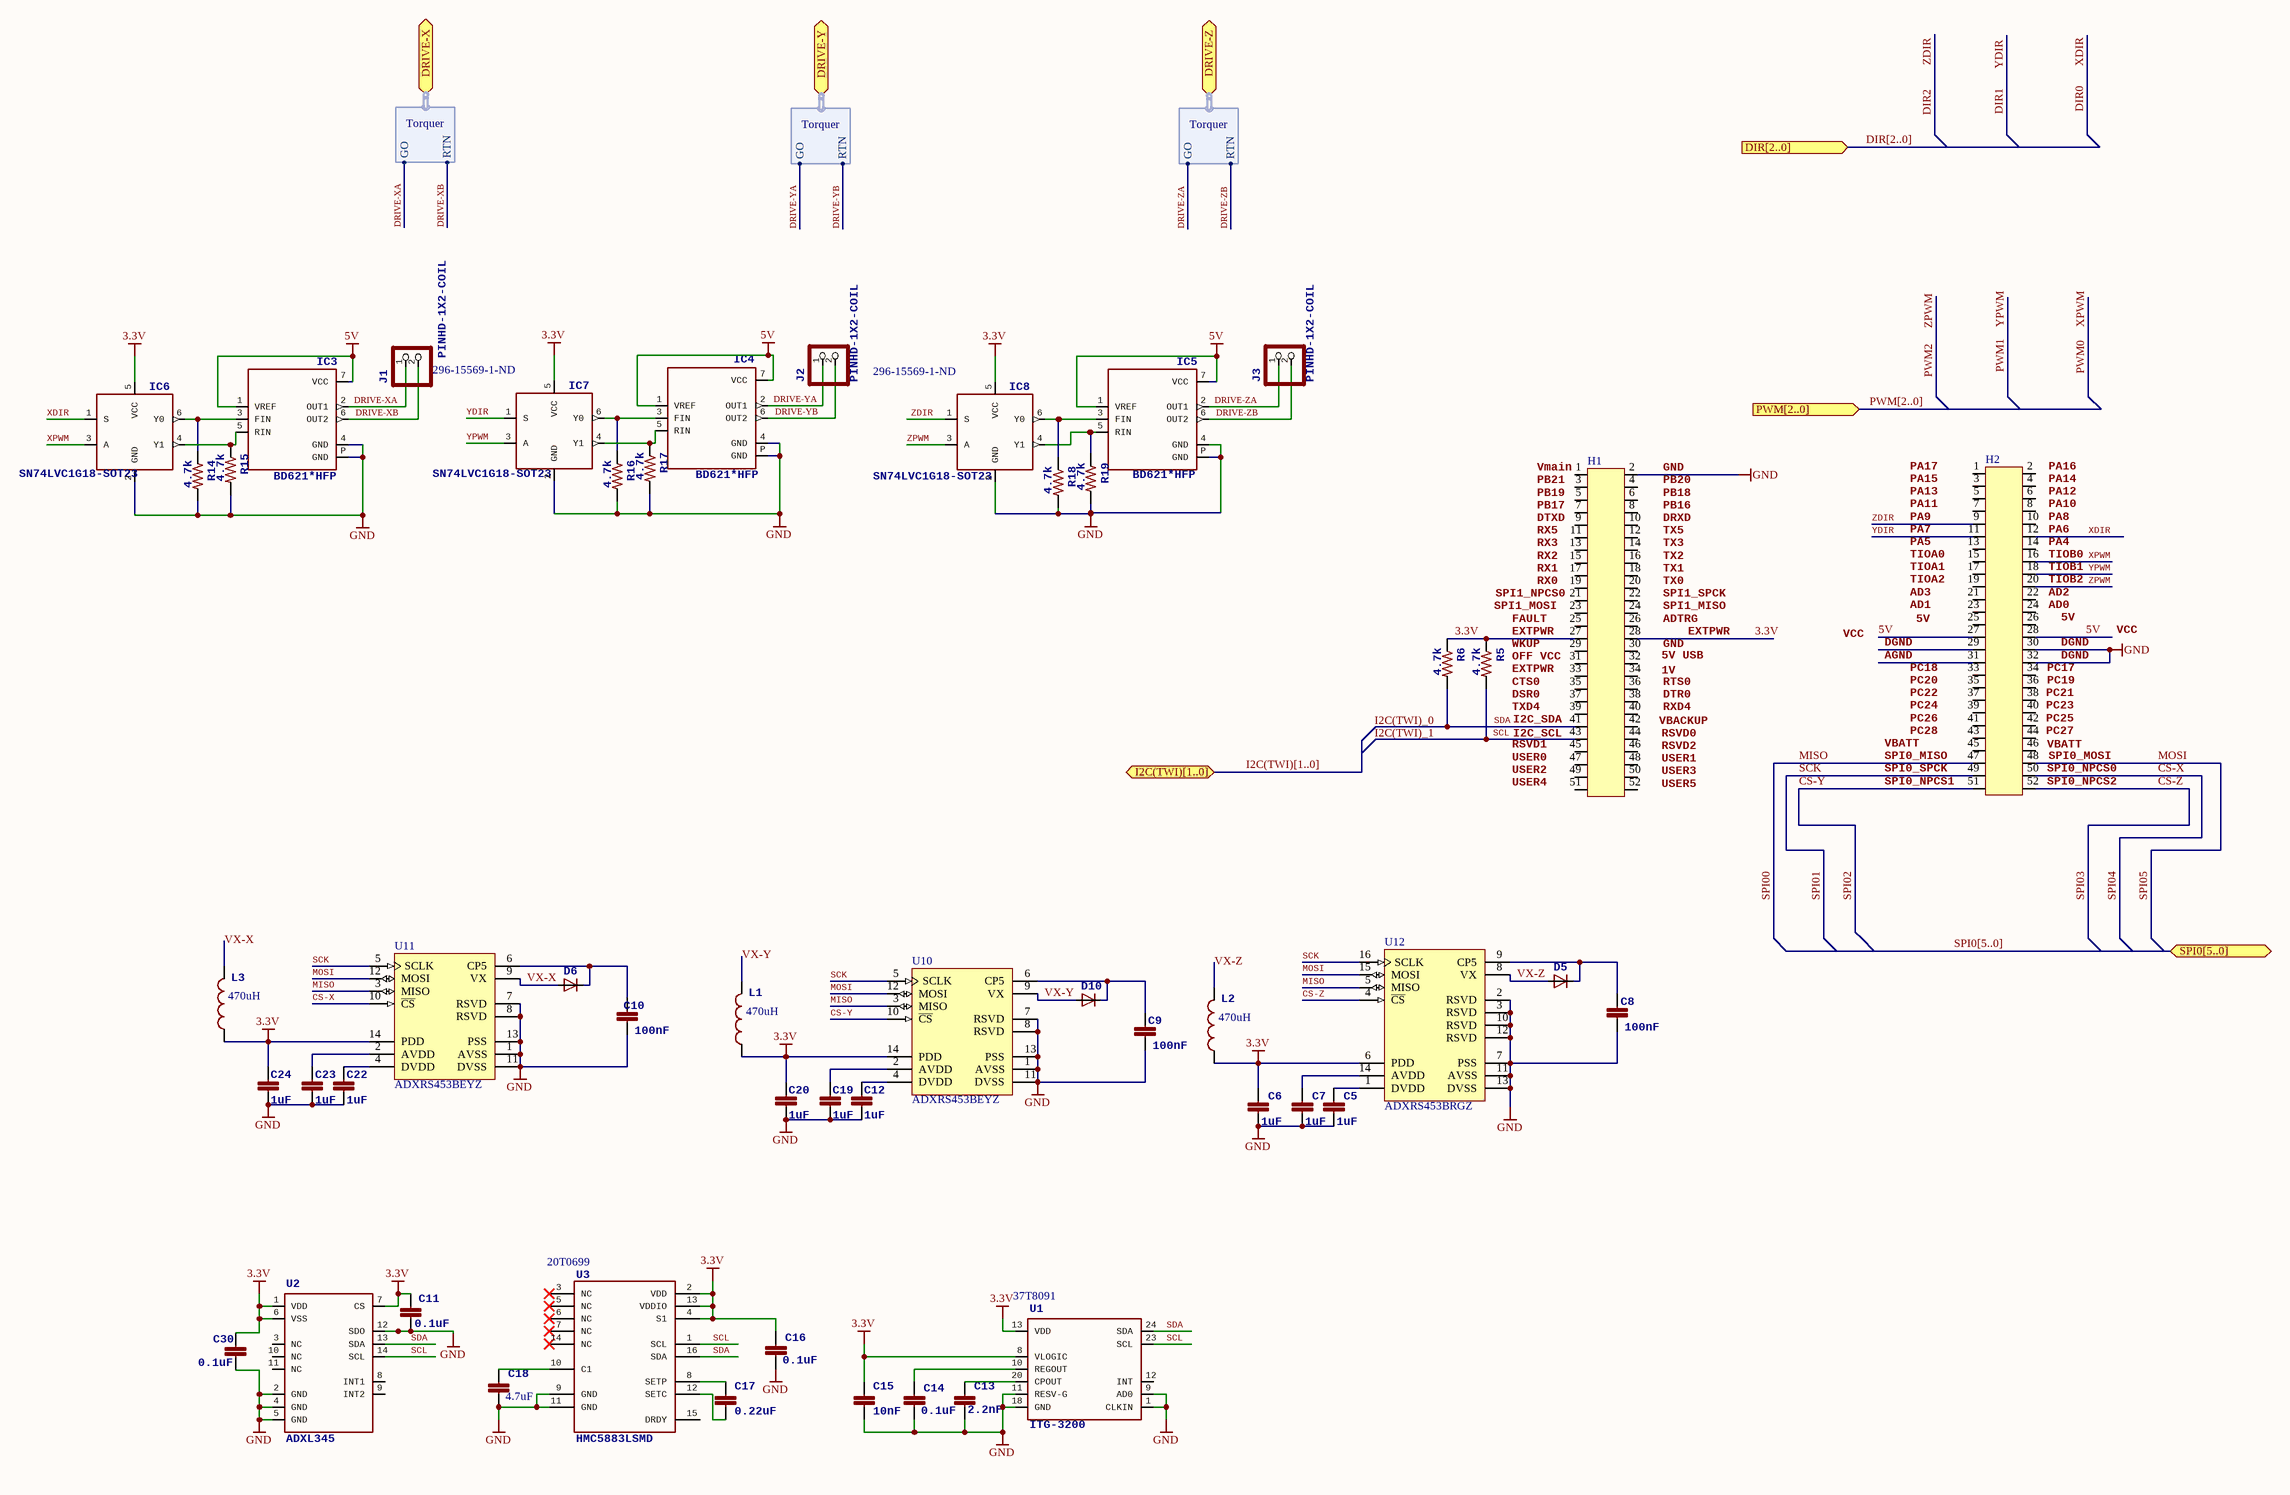
[diagram p3: ACS.SchDoc.SchDoc]

### Parts
(Parts that share a designator on the sheet are numbered #1, #2 ... from top to bottom, then left to right.)
C5  1uF  [0603-CAP]
C6  1uF  [0603-CAP]
C7  1uF  [0603-CAP]
C8  100nF  [0603-CAP]
C9  100nF  [0603-CAP]
C10  100nF  [0603-CAP]
C11  0.1uF  [0603-CAP]
C12  1uF  [0603-CAP]
C13  2.2nF  [0603-CAP]
C14  0.1uF  [0603-CAP]
C15  10nF  [0603-CAP]
C16  0.1uF  [0603-CAP]
C17  0.22uF  [0603-CAP]
C18  value 4.7uF  [0603-CAP]  (hidden comment: <b>Capacitor</b> / Standard SMT, and 0.1", and 0.2" leaded ceramic capacitors)
C19  1uF  [0603-CAP]
C20  1uF  [0603-CAP]
C22  1uF  [0603-CAP]
C23  1uF  [0603-CAP]
C24  1uF  [0603-CAP]
C30  0.1uF  [0603-CAP]
D5  <b>Diode</b> / Standard reverse protection diodes and small signal diodes.  [DIODE-SMA]  (value not drawn)
D6  <b>Diode</b> / Standard reverse protection diodes and small signal diodes.  [DIODE-SMA]  (value not drawn)
D10  <b>Diode</b> / Standard reverse protection diodes and small signal diodes.  [DIODE-SMA]  (value not drawn)
H1#3  H?  [SAMTEC_ESQ_126_39_G_D]  (value not drawn)
H2#3  H?  [SAMTEC_ESQ_126_39_G_D]  (value not drawn)
IC3  BD621*HFP  [HRP7]
IC4  BD621*HFP  [HRP7]
IC5  BD621*HFP  [HRP7]
IC6  SN74LVC1G18-SOT23  [SOT23-6]
IC7  SN74LVC1G18-SOT23  Supplier Part Number 1: 296-15569-1-ND  [SOT23-6]
IC8  SN74LVC1G18-SOT23  Supplier Part Number 1: 296-15569-1-ND  [SOT23-6]
J1  PINHD-1X2-COIL  [HEADER-1X2-COIL]
J2  PINHD-1X2-COIL  [HEADER-1X2-COIL]
J3#2  PINHD-1X2-COIL  [HEADER-1X2-COIL]
L1#2  value 470uH  [1210]  (hidden comment: <b>Inductors</b>)
L2#2  value 470uH  [1210]  (hidden comment: <b>Inductors</b>)
L3#2  value 470uH  [1210]  (hidden comment: Inductor)
R5  4.7k  [0603-RES]
R6  4.7k  [0603-RES]
R14  4.7k  [0603-RES]
R15  4.7k  [0603-RES]
R16  4.7k  [0603-RES]
R17  4.7k  [0603-RES]
R18  4.7k  [0603-RES]
R19  4.7k  [0603-RES]
U1#1  ITG-3200  Supplier Part Number 1: 37T8091  [QFN-24]
U2#1  ADXL345  [LGA14]
U3  HMC5883LSMD  Supplier Part Number 1: 20T0699  [16LPCC]
U10  ADXRS453BEYZ  [ADI-EY-14-1_V]
U11  ADXRS453BEYZ  [ADI-EY-14-1_V]
U12  ADXRS453BRGZ  [ADI-RG-16-1_M]

### Ports
DIR[2..0] (in), DRIVE-X (harness Torquer), DRIVE-Y (harness Torquer), DRIVE-Z (harness Torquer), I2C(TWI)[1..0] (bidir), PWM[2..0] (in), SPI0[5..0] (bidir)

### Harnesses
Torquer: GO, RTN

### Nets
3.3V: C6.2 C11.1 C15.1 C16.1 C20.2 C24.2 C30.1 H1#3.27 H1#3.28 IC6.5(VCC) IC7.5(VCC) IC8.5(VCC) L1#2.1 L2#2.1 L3#2.1 R5.1 R6.1 U1#1.8(VLOGIC) U1#1.13(VDD) U2#1.1(VDD) U2#1.6(VSS) U2#1.7(CS) U3.2(VDD) U3.4(S1) U3.13(VDDIO) U10.14(PDD) U11.14(PDD) U12.6(PDD)
5V: H2#3.27 H2#3.28 IC3.1(VREF) IC3.7(VCC) IC4.1(VREF) IC4.7(VCC) IC5.1(VREF) IC5.7(VCC)
GND: C5.1 C6.1 C7.1 C8.2 C9.2 C10.2 C11.2 C12.1 C13.2 C14.2 C15.2 C16.2 C18.2 C19.1 C20.1 C22.1 C23.1 C24.1 C30.2 H1#3.2 H2#3.30 H2#3.32 IC3.4(GND) IC3.P(GND) IC4.4(GND) IC4.P(GND) IC5.4(GND) IC5.P(GND) IC6.2(GND) IC7.2(GND) IC8.2(GND) R14.2 R15.2 R16.2 R17.2 R18.2 R19.2 U1#1.1(CLKIN) U1#1.9(AD0) U1#1.11(RESV-G) U1#1.18(GND) U2#1.2(GND) U2#1.4(GND) U2#1.5(GND) U2#1.12(SDO) U3.9(GND) U3.11(GND) U10.1(AVSS) U10.7(RSVD) U10.8(RSVD) U10.11(DVSS) U10.13(PSS) U11.1(AVSS) U11.7(RSVD) U11.8(RSVD) U11.11(DVSS) U11.13(PSS) U12.2(RSVD) U12.3(RSVD) U12.7(PSS) U12.10(RSVD) U12.11(AVSS) U12.12(RSVD) U12.13(DVSS)  [project net Array-]
CS-X: H2#3.50 U11.10(~{CS})  [also labelled SPI04]
CS-Y: H2#3.51 U10.10(~{CS})  [also labelled SPI02]
CS-Z: H2#3.52 U12.4(~{CS})  [also labelled SPI03]
DIR0: H2#3.12 IC6.1(S)  [also labelled XDIR]
DIR1: H2#3.11 IC7.1(S)  [also labelled YDIR]
DIR2: H2#3.9 IC8.1(S)  [also labelled ZDIR]
DRIVE-XA: IC3.2(OUT1) J1.1 ; port DRIVE-X.GO
DRIVE-XB: IC3.6(OUT2) J1.2 ; port DRIVE-X.RTN
DRIVE-YA: IC4.2(OUT1) J2.1 ; port DRIVE-Y.GO
DRIVE-YB: IC4.6(OUT2) J2.2 ; port DRIVE-Y.RTN
DRIVE-ZA: IC5.2(OUT1) J3#2.1 ; port DRIVE-Z.GO
DRIVE-ZB: IC5.6(OUT2) J3#2.2 ; port DRIVE-Z.RTN
I2C(TWI)_0: H1#3.41 R6.2 U1#1.24(SDA) U2#1.13(SDA) U3.16(SDA)  [also labelled SDA]
I2C(TWI)_1: H1#3.43 R5.2 U1#1.23(SCL) U2#1.14(SCL) U3.1(SCL)  [also labelled SCL]
MISO: H2#3.47 U10.3(MISO) U11.3(MISO) U12.5(MISO)  [also labelled SPI00]
MOSI: H2#3.48 U10.12(MOSI) U11.12(MOSI) U12.15(MOSI)  [also labelled SPI05]
PWM0: H2#3.16 IC6.3(A)  [also labelled XPWM]
PWM1: H2#3.18 IC7.3(A)  [also labelled YPWM]
PWM2: H2#3.20 IC8.3(A)  [also labelled ZPWM]
SCK: H2#3.49 U10.5(SCLK) U11.5(SCLK) U12.16(SCLK)  [also labelled SPI01]
VX-X: D6.A L3#2.2 U11.9(VX)
VX-Y: D10.A L1#2.2 U10.9(VX)
VX-Z: D5.A L2#2.2 U12.8(VX)
NetC5_2: C5.2 U12.1(DVDD)
NetC7_2: C7.2 U12.14(AVDD)
NetC8_1: C8.1 D5.C U12.9(CP5)
NetC9_1: C9.1 D10.C U10.6(CP5)
NetC10_1: C10.1 D6.C U11.6(CP5)
NetC12_2: C12.2 U10.4(DVDD)
NetC13_1: C13.1 U1#1.20(CPOUT)
NetC14_1: C14.1 U1#1.10(REGOUT)
NetC17_1: C17.1 U3.8(SETP)
NetC17_2: C17.2 U3.12(SETC)
NetC18_1: C18.1 U3.10(C1)
NetC19_2: C19.2 U10.2(AVDD)
NetC22_2: C22.2 U11.4(DVDD)
NetC23_2: C23.2 U11.2(AVDD)
NetIC3_3: IC3.3(FIN) IC6.6(Y0) R14.1
NetIC3_5: IC3.5(RIN) IC6.4(Y1) R15.1
NetIC4_3: IC4.3(FIN) IC7.6(Y0) R16.1
NetIC4_5: IC4.5(RIN) IC7.4(Y1) R17.1
NetIC5_3: IC5.3(FIN) IC8.6(Y0) R18.1
NetIC5_5: IC5.5(RIN) IC8.4(Y1) R19.1

Not connected (* = marked no-connect by the designer): H1#3 1 3 4 5 6 7 8 9 10 11 12 13 14 15 16 17 18 19 20 21 22 23 24 25 26 29 30 31 32 33 34 35 36 37 38 39 40 42 44 45 46 47 48 49 50 51 52; H2#3 1 2 3 4 5 6 7 8 10 13 14 15 17 19 21 22 23 24 25 26 29 31 33 34 35 36 37 38 39 40 41 42 43 44 45 46; U1#1 12(INT); U2#1 3(NC) 8(INT1) 9(INT2) 10(NC) 11(NC); U3 3(NC)* 5(NC)* 6(NC)* 7(NC)* 14(NC)* 15(DRDY)

### Buses and harness runs
bus DIR[2..0] = port DIR[2..0]
bus I2C(TWI)[1..0] = port I2C(TWI)[1..0]
bus PWM[2..0] = port PWM[2..0]
bus SPI0[5..0] = port SPI0[5..0]

### Notes on the sheet
- (near H1#3) Vmain
- (near H1#3) PB21
- (near H1#3) GND
- (near H1#3) PB20
- PA17
- PA15
- (near H2#3) PA16
- (near H2#3) PA14
- (near H1#3) PB19
- (near H1#3) PB17
- (near H1#3) DTXD
- (near H1#3) RX5
- (near H1#3) RX3
- (near H1#3) PB18
- (near H1#3) PB16
- (near H1#3) DRXD
- (near H1#3) TX5
- (near H1#3) TX3
- PA13
- PA11
- PA9
- PA7
- PA5
- (near H2#3) PA12
- (near H2#3) PA10
- (near H2#3) PA8
- (near H2#3) PA6
- (near H2#3) PA4
- SPI1_MOSI
- SPI1_NPCS0
- (near H1#3) RX2
- (near H1#3) RX1
- (near H1#3) RX0
- (near H1#3) TX2
- (near H1#3) TX1
- (near H1#3) TX0
- (near H1#3) SPI1_SPCK
- (near H1#3) SPI1_MISO
- (near H2#3) TIOA0
- (near H2#3) TIOA1
- (near H2#3) TIOA2
- AD3
- AD1
- (near H2#3) TIOB0
- (near H2#3) TIOB1
- (near H2#3) TIOB2
- (near H2#3) AD2
- (near H2#3) AD0
- FAULT
- EXTPWR
- (near R5) WKUP
- OFF VCC
- (near H1#3) 5V USB
- (near H1#3) 1V
- (near H1#3) ADTRG
- VCC
- DGND
- AGND
- PC18
- 5V
- (near H2#3) PC17
- (near H2#3) 5V
- (near H2#3) DGND
- (near R5) CTS0
- (near R5) DSR0
- TXD4
- I2C_SDA
- (near H1#3) I2C_SCL
- (near H1#3) VBACKUP
- (near H1#3) RSVD0
- (near H1#3) RTS0
- (near H1#3) DTR0
- (near H1#3) RXD4
- PC20
- PC22
- PC24
- PC26
- PC28
- (near H2#3) PC21
- (near H2#3) PC23
- (near H2#3) PC25
- (near H2#3) PC27
- (near H2#3) PC19
- RSVD1
- (near H1#3) USER0
- (near H1#3) USER2
- (near H1#3) USER4
- (near H1#3) RSVD2
- (near H1#3) USER1
- (near H1#3) USER3
- (near H1#3) USER5
- VBATT
- (near H2#3) SPI0_MISO
- (near H2#3) SPI0_SPCK
- (near H2#3) SPI0_NPCS1
- (near H2#3) VBATT
- (near H2#3) SPI0_NPCS0
- (near H2#3) SPI0_NPCS2
- (near H2#3) SPI0_MOSI

### Library data of the parts
C5-C17 C19 C20 C22-C24 C30 = CAPACITOR-0603: <b>Capacitor</b> / Standard SMT, and 0.1", and 0.2" leaded ceramic capacitors; Supplier 1: Digi-Key
  C5-C7 C12 C19 C20 C22-C24: Value: 1 uF; Supplier Part Number 1: 1276-1024-1-ND
  C8-C11 C14 C16 C30: Supplier Part Number 1: 399-1096-1-ND
  C13: Supplier Part Number 1: 399-1085-1-ND
  C15: Supplier Part Number 1: 399-1091-1-ND
  C17: Supplier Part Number 1: 445-1318-1-ND
C18 = CAPACITOR-0603: Supplier 1: Digi-Key; Supplier Part Number 1: 445-9120-1-ND
D5 D6 D10 = DIODE-SMA: Supplier 1: Digi-Key; Supplier Part Number 1: SMAJ4744A-TPCT-ND
H1#3 H2#3 = SAMTEC_ESQ_126_39_G_D: 26X2 header
IC3 = BD621*HFP: H-bridge driver for brush motors BD621* have minimum 3V power input, BD62*2 have 2A current rating</p> / Source: http://www.rohm.com/products/databook/motor/pdf/bd623x_series-e.pdf; MPN: BD6232HFP-TR; OC_FARNELL: 1712947; OC_NEWARK: 24R5627; Supplier 1: Digi-Key; Supplier Part Number 1: BD6212HFPCT-ND
IC4 IC5 = BD621*HFP: <b>H-bridge driver</b> for brush motors / <p>BD621* have minimum 3V power input, BD62*2 have 2A current rating</p> / Source: http://www.rohm.com/products/databook/motor/pdf/bd623x_series-e.pdf; MPN: BD6232HFP-TR; OC_FARNELL: 1712947; OC_NEWARK: 24R5627; Supplier 1: Digi-Key; Supplier Part Number 1: BD6212HFPCT-ND
IC6-IC8 = SN74LVC1G18-SOT23: <b>1-of-2 Noninverting Demultiplexer with 3-state Deselected Output</b> / <p>Function-Compatible with SN74AUC1G19 Decoder/Demultiplexer (for High Deselected Output)<p>; Supplier 1: Digi-Key
  IC6: Supplier Part Number 1: 296-15568-1-ND
L1#2 L2#2 L3#2 = INDUCTOR-1210_470uH: Supplier 1: Digi-Key; Supplier Part Number 1: 490-2499-1-ND
R5 R6 R14-R19 = RESISTOR-0603: <p><b>Resistor</b></p> / Basic schematic elements and footprints for resistors.; Supplier 1: Digi-Key; Supplier Part Number 1: P4.7KGCT-ND
U1#1 = ITG-3200: ITG-3200 3-axis gyro, digital output, qfn24 package; Supplier 1: Newark
U3 = HMC5883LSMD: 3 Axis Digital Compass IC; Supplier 1: Newark
U10 U11 = CMP-0885-00107-1: High Performance, Digital Output Gyroscope with SPI, 77.5 Hz BW, Industrial, 14-pin LCC, Tube; Manufacturer: Analog Devices; Nonliniarity: 0.05% of FS rms; Supply Current: 6 mA; Temp Sensor: Yes; Sensitivity: 80 LSB/degrees/s; Voltage Reference: No; Voltage Supply (V): 3.15 to 5.25; PackageVersion: 05-23-2011-B, 05/2011; Output Type: Digital; ComponentLink1Description: Manufacturer URL; ComponentLink2Description: Datasheet; ComponentLink3URL: http:/www.analog.com/static/imported-files/packages/PKG_PDF/LCC(E)/EY_14_1.pdf; ComponentLink4URL: http://www.analog.com/en/mems-sensors/mems-inertial-sensors/adxrs453/products/product.html; ComponentLink2URL: http://www.analog.com/static/imported-files/data_sheets/ADXRS453.pdf; ComponentLink3Description: Package Specification; PartNumber: ADXRS453BEYZ; ComponentLink1URL: http://www.analog.com/en/index.html; PackageReference: EY-14-1; PackageDescription: 14-Pin Ceramic Leadless Chip Carrier, Vertical Form, 9 x 9 mm Body; DatasheetVersion: Rev. B; Mounting Technology: Surface Mount; ComponentLink4Description: Product URL; Packing: Tube; Supplier 1: Digi-Key; Supplier Part Number 1: ADXRS453BEYZ-ND
U12 = CMP-0885-00109-1: High Performance, Digital Output Gyroscope with SPI, 77.5 Hz BW, Industrial, 16-pin SOIC, Tube; Manufacturer: Analog Devices; Sensitivity: 80 LSB/degrees/s; Supply Current: 6 mA; Temp Sensor: Yes; Voltage Supply (V): 3.15 to 5.25; Voltage Reference: No; Nonliniarity: 0.05% of FS rms; ComponentLink1Description: Manufacturer URL; ComponentLink4URL: http://www.analog.com/en/mems-sensors/mems-inertial-sensors/adxrs453/products/product.html; Packing: Tube; ComponentLink2Description: Datasheet; DatasheetVersion: Rev. B; Mounting Technology: Surface Mount; PackageReference: RG-16-1; ComponentLink3Description: Package Specification; ComponentLink2URL: http://www.analog.com/static/imported-files/data_sheets/ADXRS453.pdf; ComponentLink4Description: Product URL; PackageDescription: 16-Pin Small Outline, Plastic Cavity Package, 10.3 x 7.8 mm Body, 1.27 mm Pitch; ComponentLink1URL: http://www.analog.com/en/index.html; PartNumber: ADXRS453BRGZ; ComponentLink3URL: http:/www.analog.com/static/imported-files/packages/PKG_PDF/SOIC_PCP(RG)/RG_16_1.pdf; Output Type: Digital; PackageVersion: 01-30-2013-B, 01/2013; Supplier 1: Digi-Key; Supplier Part Number 1: ADXRS453BRGZ-ND
J1 J2 J3#2 = PINHD-1X2-COIL: Supplier 1: Digi-Key; Supplier Part Number 1: WM18920-ND
U2#1 = ADXL345: Supplier 1: Digi-Key; Supplier Part Number 1: ADXL345BCCZ-RLCT-ND

## Sheet FIPEX.SchDoc
size A4
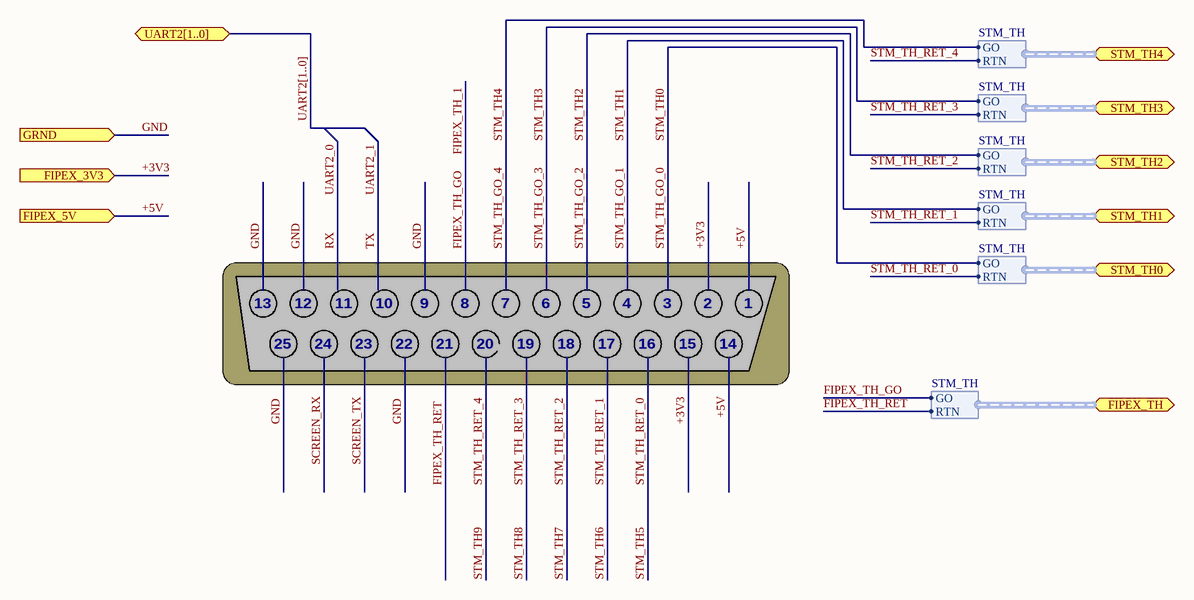
[diagram p4: FIPEX.SchDoc]

### Ports
FIPEX_3V3 (in), FIPEX_5V (in), FIPEX_TH (harness STM_TH), GRND (in), STM_TH0 (harness STM_TH), STM_TH1 (harness STM_TH), STM_TH2 (harness STM_TH), STM_TH3 (harness STM_TH), STM_TH4 (harness STM_TH), UART2[1..0] (bidir)

### Harnesses
STM_TH: GO, RTN

### Buses and harness runs
bus UART2[1..0] = port UART2[1..0]

### Notes on the sheet
- 13
- 12
- 11
- 10
- 9
- 8
- 7
- 6
- 5
- 4
- 3
- 2
- 1
- 25
- 24
- 23
- 22
- 21
- 20
- 19
- 18
- 17
- 16
- 15
- 14

## Sheet QB50SideSolarArray.SchDoc
size A4
Used 8 times, as channels U_TX, U_BX, U_TNX, U_BNX, U_TY, U_BY, U_TNY, U_BNY. Parts and nets are listed once, with the designators drawn on the sheet.
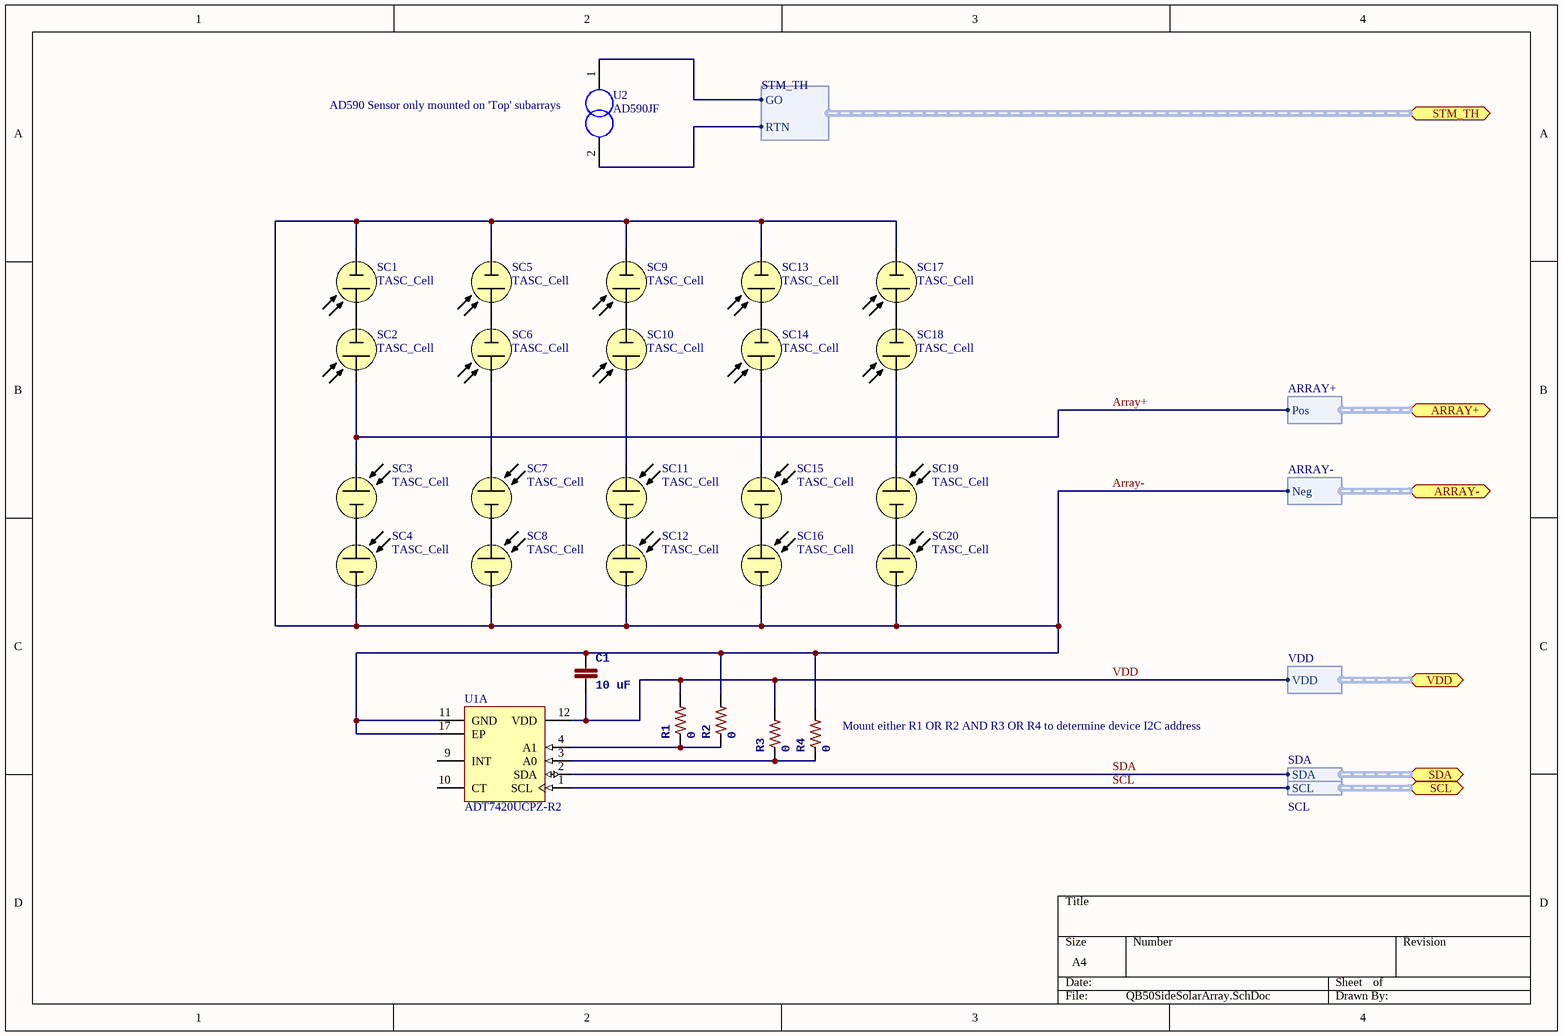
[diagram p5: QB50SideSolarArray.SchDoc]

### Parts
C1  10 uF  [0805]
R1  0  [0805]
R2  0  [0805]
R3  0  [0805]
R4  0  [0805]
SC1  TASC_Cell  [TASC Solar Cell]
SC2  TASC_Cell  [TASC Solar Cell]
SC3  TASC_Cell  [TASC Solar Cell]
SC4  TASC_Cell  [TASC Solar Cell]
SC5  TASC_Cell  [TASC Solar Cell]
SC6  TASC_Cell  [TASC Solar Cell]
SC7  TASC_Cell  [TASC Solar Cell]
SC8  TASC_Cell  [TASC Solar Cell]
SC9  TASC_Cell  [TASC Solar Cell]
SC10  TASC_Cell  [TASC Solar Cell]
SC11  TASC_Cell  [TASC Solar Cell]
SC12  TASC_Cell  [TASC Solar Cell]
SC13  TASC_Cell  [TASC Solar Cell]
SC14  TASC_Cell  [TASC Solar Cell]
SC15  TASC_Cell  [TASC Solar Cell]
SC16  TASC_Cell  [TASC Solar Cell]
SC17  TASC_Cell  [TASC Solar Cell]
SC18  TASC_Cell  [TASC Solar Cell]
SC19  TASC_Cell  [TASC Solar Cell]
SC20  TASC_Cell  [TASC Solar Cell]
U1  ADT7420UCPZ-R2  [ADI-CP-16-17_L]  (part A of 2)
U2  AD590JF  [AD590JF]

### Ports
ARRAY+ (harness ARRAY+), ARRAY- (harness ARRAY-), SCL (harness SCL), SDA (harness SDA), STM_TH (harness STM_TH), VDD (harness VDD)

### Harnesses
ARRAY+: Pos
ARRAY-: Neg
VDD: VDD
SDA: SDA
SCL: SCL
STM_TH: GO, RTN

### Nets
Array+: SC2.Pos(+) SC3.Pos(+) ; port ARRAY+.Pos
Array-: C1.1 R2.2 R4.2 SC1.Neg(-) SC4.Neg(-) SC5.Neg(-) SC8.Neg(-) SC9.Neg(-) SC12.Neg(-) SC13.Neg(-) SC16.Neg(-) SC17.Neg(-) SC20.Neg(-) U1.11(GND) U1.17(EP) ; port ARRAY-.Neg
SCL: U1.1(SCL) ; port SCL.SCL
SDA: U1.2(SDA) ; port SDA.SDA
VDD: C1.2 R1.2 R3.2 U1.12(VDD) ; port VDD.VDD
NetR1_1: R1.1 R2.1 U1.4(A1)
NetR3_1: R3.1 R4.1 U1.3(A0)
NetSC1_Pos: SC1.Pos(+) SC2.Neg(-)
NetSC3_Neg: SC3.Neg(-) SC4.Pos(+)
NetSC5_Pos: SC5.Pos(+) SC6.Neg(-)
NetSC6_Pos: SC6.Pos(+) SC7.Pos(+)
NetSC7_Neg: SC7.Neg(-) SC8.Pos(+)
NetSC9_Pos: SC9.Pos(+) SC10.Neg(-)
NetSC10_Pos: SC10.Pos(+) SC11.Pos(+)
NetSC11_Neg: SC11.Neg(-) SC12.Pos(+)
NetSC13_Pos: SC13.Pos(+) SC14.Neg(-)
NetSC14_Pos: SC14.Pos(+) SC15.Pos(+)
NetSC15_Neg: SC15.Neg(-) SC16.Pos(+)
NetSC17_Pos: SC17.Pos(+) SC18.Neg(-)
NetSC18_Pos: SC18.Pos(+) SC19.Pos(+)
NetSC19_Neg: SC19.Neg(-) SC20.Pos(+)
NetU2_1: U2.1 ; port STM_TH.GO
NetU2_2: U2.2 ; port STM_TH.RTN

Not connected (* = marked no-connect by the designer): U1 9(INT) 10(CT)

### Channels
U_TX: designators end in _U_TX
U_BX: designators end in _U_BX
U_TNX: designators end in _U_TNX
U_BNX: designators end in _U_BNX
U_TY: designators end in _U_TY
U_BY: designators end in _U_BY
U_TNY: designators end in _U_TNY
U_BNY: designators end in _U_BNY

### Notes on the sheet
- (near U2) AD590 Sensor only mounted on 'Top' subarrays
- (near R4) Mount either R1 OR R2 AND R3 OR R4 to determine device I2C address

### Library data of the parts
C1 = CAP0805_10uF: Tolerance: ±10%; Voltage - Rated: 10V; Temperature Coefficient: X5R; RoHS: RoHS Compliant; Category: Capacitors; Packaging: Tape & Reel (TR); Mounting Type: Surface Mount, MLCC; Operating Temperature: -55°C ~ 125°C; Applications: General Purpose; Ratings: -; Package / Case: 0805 (2012 Metric); Size / Dimension: 0.079" L x 0.049" W (2.00mm x 1.25mm); Thickness (Max): 0.039" (1.00mm); Value: 10 uF; Supplier 1: Digi-Key; Supplier Part Number 1: 445-7660-1-ND
R1-R4 = RES_0805_0: Manufacturer: TE Connectivity; Manufacturer Part Number: 1625856-2; Resistance (Ohms): 100M; Tolerance: ±10%; Power (Watts): 0.125W, 1/8W; Temperature Coefficient: ±100ppm/°C; RoHS: RoHS Compliant; Category: Resistors; Packaging: Cut Tape (CT); Composition: Thick Film; Features: -; Operating Temperature: -55°C ~ 125°C; Package / Case: 0805 (2012 Metric); Supplier Device Package: 0805; Size / Dimension: 0.079" L x 0.047" W (2.00mm x 1.20mm); Height: 0.020" (0.50mm); Number of Terminations: 2; ComponentLink1URL: http://www.te.com/commerce/DocumentDelivery/DDEController?Action=srchrtrv&DocNm=1625856&DocType=Customer+Drawing&DocLang=English; ComponentLink1Description: http://www.te.com/commerce/DocumentDelivery/DDEController?Action=srchrtrv&DocNm=1625856&DocType=Customer+Drawing&DocLang=English; Value: 0; Supplier 1: Digi-Key; Supplier Part Number 1: RHM0.0ARCT-ND
U1 = CMP-0886-00002-1: +/-0.25 Deg Accurate, 16-Bit Digital I2C Temperature Sensor, 2.7 to 5.5 V Supply, Industrial, 16-pin QFN (CP-16-17), Reel; Manufacturer: Analog Devices; ComponentLink3URL: http://www.analog.com/static/imported-files/packages/PKG_PDF/LFCSP(CP)/CP_16_17.pdf; ComponentLink1URL: http://www.analog.com/en/index.html; ComponentLink3Description: Package Specification; ComponentLink4URL: http://www.analog.com/en/mems-sensors/digital-temperature-sensors/adt7420/products/product.html; ComponentLink2URL: http://www.analog.com/static/imported-files/data_sheets/ADT7420.pdf; DatasheetVersion: Rev. 0; PartNumber: ADT7420UCPZ-R2; PackageVersion: 08-16-2010-C; Mounting Technology: Surface Mount; Packing: Reel; PackageDescription: 16-Pin Lead Frame Chip Scale Package, Body 4 x 4 mm, Pitch 0.65 mm; ComponentLink4Description: Product URL; Code_JEDEC: MO-220-WGGC; ComponentLink1Description: Manufacturer URL; Supply Voltage Range: 2.7 to 5.5 V; ComponentLink2Description: Datasheet; PackageReference: CP-16-17
U2 = AD590JF: Supplier 1: Digi-Key; Supplier Part Number 1: AD590JF-ND

## Sheet QB50NZSolarArray.SchDoc
size A4
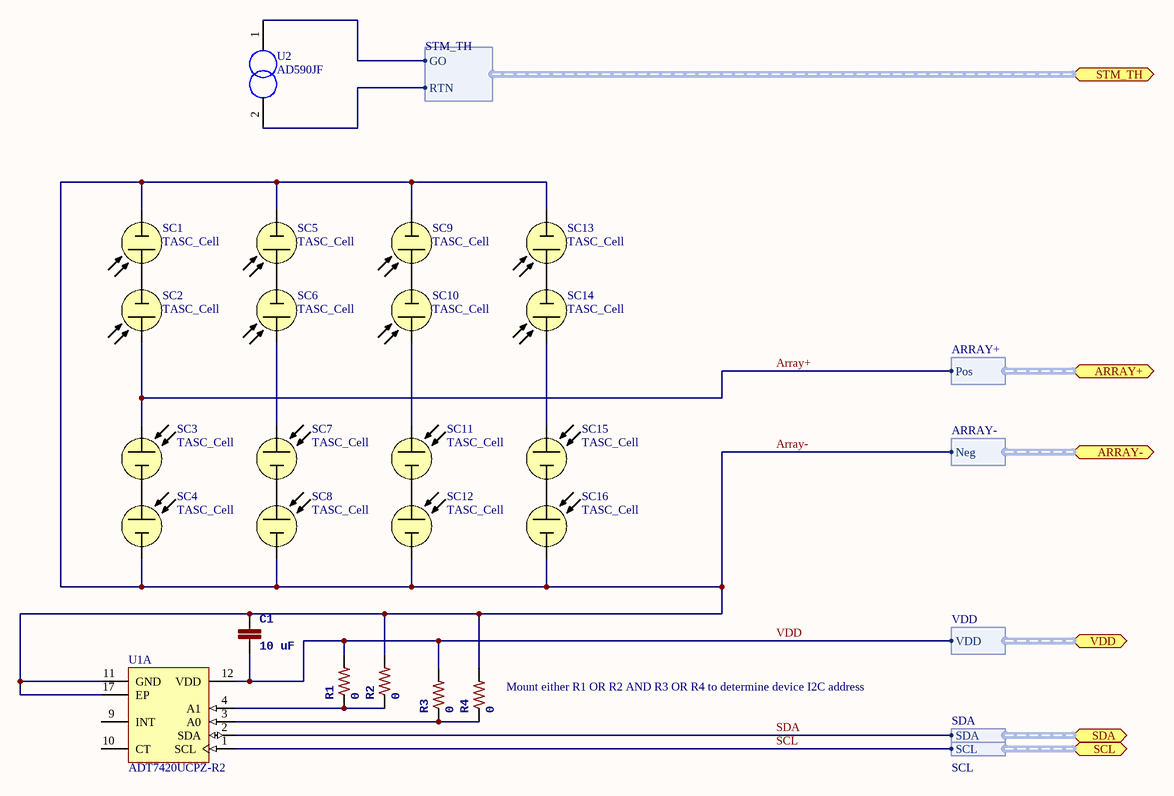
[diagram p6: QB50NZSolarArray.SchDoc]

### Parts
(Parts that share a designator on the sheet are numbered #1, #2 ... from top to bottom, then left to right.)
C1  10 uF  [0805]
R1#2  0  [0805]
R2#2  0  [0805]
R3  0  [0805]
R4  0  [0805]
SC1  TASC_Cell  [TASC Solar Cell]
SC2  TASC_Cell  [TASC Solar Cell]
SC3  TASC_Cell  [TASC Solar Cell]
SC4  TASC_Cell  [TASC Solar Cell]
SC5  TASC_Cell  [TASC Solar Cell]
SC6  TASC_Cell  [TASC Solar Cell]
SC7  TASC_Cell  [TASC Solar Cell]
SC8  TASC_Cell  [TASC Solar Cell]
SC9  TASC_Cell  [TASC Solar Cell]
SC10  TASC_Cell  [TASC Solar Cell]
SC11  TASC_Cell  [TASC Solar Cell]
SC12  TASC_Cell  [TASC Solar Cell]
SC13  TASC_Cell  [TASC Solar Cell]
SC14  TASC_Cell  [TASC Solar Cell]
SC15  TASC_Cell  [TASC Solar Cell]
SC16  TASC_Cell  [TASC Solar Cell]
U1#2  ADT7420UCPZ-R2  [ADI-CP-16-17_L]  (part A of 2)
U2#2  AD590JF  [AD590JF]

### Ports
ARRAY+ (harness ARRAY+), ARRAY- (harness ARRAY-), SCL (harness SCL), SDA (harness SDA), STM_TH (harness STM_TH), VDD (harness VDD)

### Harnesses
ARRAY+: Pos
ARRAY-: Neg
VDD: VDD
SDA: SDA
SCL: SCL
STM_TH: GO, RTN

### Nets
Array+: SC2.Pos(+) SC3.Pos(+) ; port ARRAY+.Pos
Array-: C1.1 R2#2.2 R4.2 SC1.Neg(-) SC4.Neg(-) SC5.Neg(-) SC8.Neg(-) SC9.Neg(-) SC12.Neg(-) SC13.Neg(-) SC16.Neg(-) U1#2.11(GND) U1#2.17(EP) ; port ARRAY-.Neg
SCL: U1#2.1(SCL) ; port SCL.SCL  [project net ARRAYNZ.9.SCL.SCL]
SDA: U1#2.2(SDA) ; port SDA.SDA  [project net ARRAYNZ.7.SDA.SDA]
STM_TH0: U2#2.1 ; port STM_TH.GO
STM_TH5: U2#2.2 ; port STM_TH.RTN
VDD: C1.2 R1#2.2 R3.2 U1#2.12(VDD) ; port VDD.VDD  [project net ARRAYNX.5.VDD.VDD]
NetR1#2_1: R1#2.1 R2#2.1 U1#2.4(A1)
NetR3_1: R3.1 R4.1 U1#2.3(A0)
NetSC1_Pos: SC1.Pos(+) SC2.Neg(-)
NetSC3_Neg: SC3.Neg(-) SC4.Pos(+)
NetSC5_Pos: SC5.Pos(+) SC6.Neg(-)
NetSC6_Pos: SC6.Pos(+) SC7.Pos(+)
NetSC7_Neg: SC7.Neg(-) SC8.Pos(+)
NetSC9_Pos: SC9.Pos(+) SC10.Neg(-)
NetSC10_Pos: SC10.Pos(+) SC11.Pos(+)
NetSC11_Neg: SC11.Neg(-) SC12.Pos(+)
NetSC13_Pos: SC13.Pos(+) SC14.Neg(-)
NetSC14_Pos: SC14.Pos(+) SC15.Pos(+)
NetSC15_Neg: SC15.Neg(-) SC16.Pos(+)

Not connected (* = marked no-connect by the designer): U1#2 9(INT) 10(CT)

### Notes on the sheet
- (near R4) Mount either R1 OR R2 AND R3 OR R4 to determine device I2C address

### Library data of the parts
C1 = CAP0805_10uF: as C1 on sheet QB50SideSolarArray; RoHS: RoHS Compliant; Category: Capacitors; Packaging: Tape & Reel (TR); Mounting Type: Surface Mount, MLCC; Operating Temperature: -55°C ~ 125°C; Applications: General Purpose; Ratings: -; Package / Case: 0805 (2012 Metric); Size / Dimension: 0.079" L x 0.049" W (2.00mm x 1.25mm); Thickness (Max): 0.039" (1.00mm); Value: 10 uF; Supplier 1: Digi-Key; Supplier Part Number 1: 445-7660-1-ND
R1#2 R2#2 R3 R4 = RES_0805_0: as R1 on sheet QB50SideSolarArray; RoHS: RoHS Compliant; Category: Resistors; Packaging: Cut Tape (CT); Composition: Thick Film; Features: -; Operating Temperature: -55°C ~ 125°C; Package / Case: 0805 (2012 Metric); Supplier Device Package: 0805; Size / Dimension: 0.079" L x 0.047" W (2.00mm x 1.20mm); Height: 0.020" (0.50mm); Number of Terminations: 2; ComponentLink1URL: http://www.te.com/commerce/DocumentDelivery/DDEController?Action=srchrtrv&DocNm=1625856&DocType=Customer+Drawing&DocLang=English; ComponentLink1Description: http://www.te.com/commerce/DocumentDelivery/DDEController?Action=srchrtrv&DocNm=1625856&DocType=Customer+Drawing&DocLang=English; Value: 0; Supplier 1: Digi-Key; Supplier Part Number 1: RHM0.0ARCT-ND
U1#2 = CMP-0886-00002-1: as U1 on sheet QB50SideSolarArray; ComponentLink3URL: http://www.analog.com/static/imported-files/packages/PKG_PDF/LFCSP(CP)/CP_16_17.pdf; ComponentLink1URL: http://www.analog.com/en/index.html; ComponentLink3Description: Package Specification; ComponentLink4URL: http://www.analog.com/en/mems-sensors/digital-temperature-sensors/adt7420/products/product.html; ComponentLink2URL: http://www.analog.com/static/imported-files/data_sheets/ADT7420.pdf; DatasheetVersion: Rev. 0; PartNumber: ADT7420UCPZ-R2; PackageVersion: 08-16-2010-C; Mounting Technology: Surface Mount; Packing: Reel; PackageDescription: 16-Pin Lead Frame Chip Scale Package, Body 4 x 4 mm, Pitch 0.65 mm; ComponentLink4Description: Product URL; Code_JEDEC: MO-220-WGGC; ComponentLink1Description: Manufacturer URL; Supply Voltage Range: 2.7 to 5.5 V; ComponentLink2Description: Datasheet; PackageReference: CP-16-17
U2#2 = AD590JF: Supplier 1: Digi-Key; Supplier Part Number 1: AD590JF-ND

## Sheet NanoAvionics_ICD.SchDoc
size A4
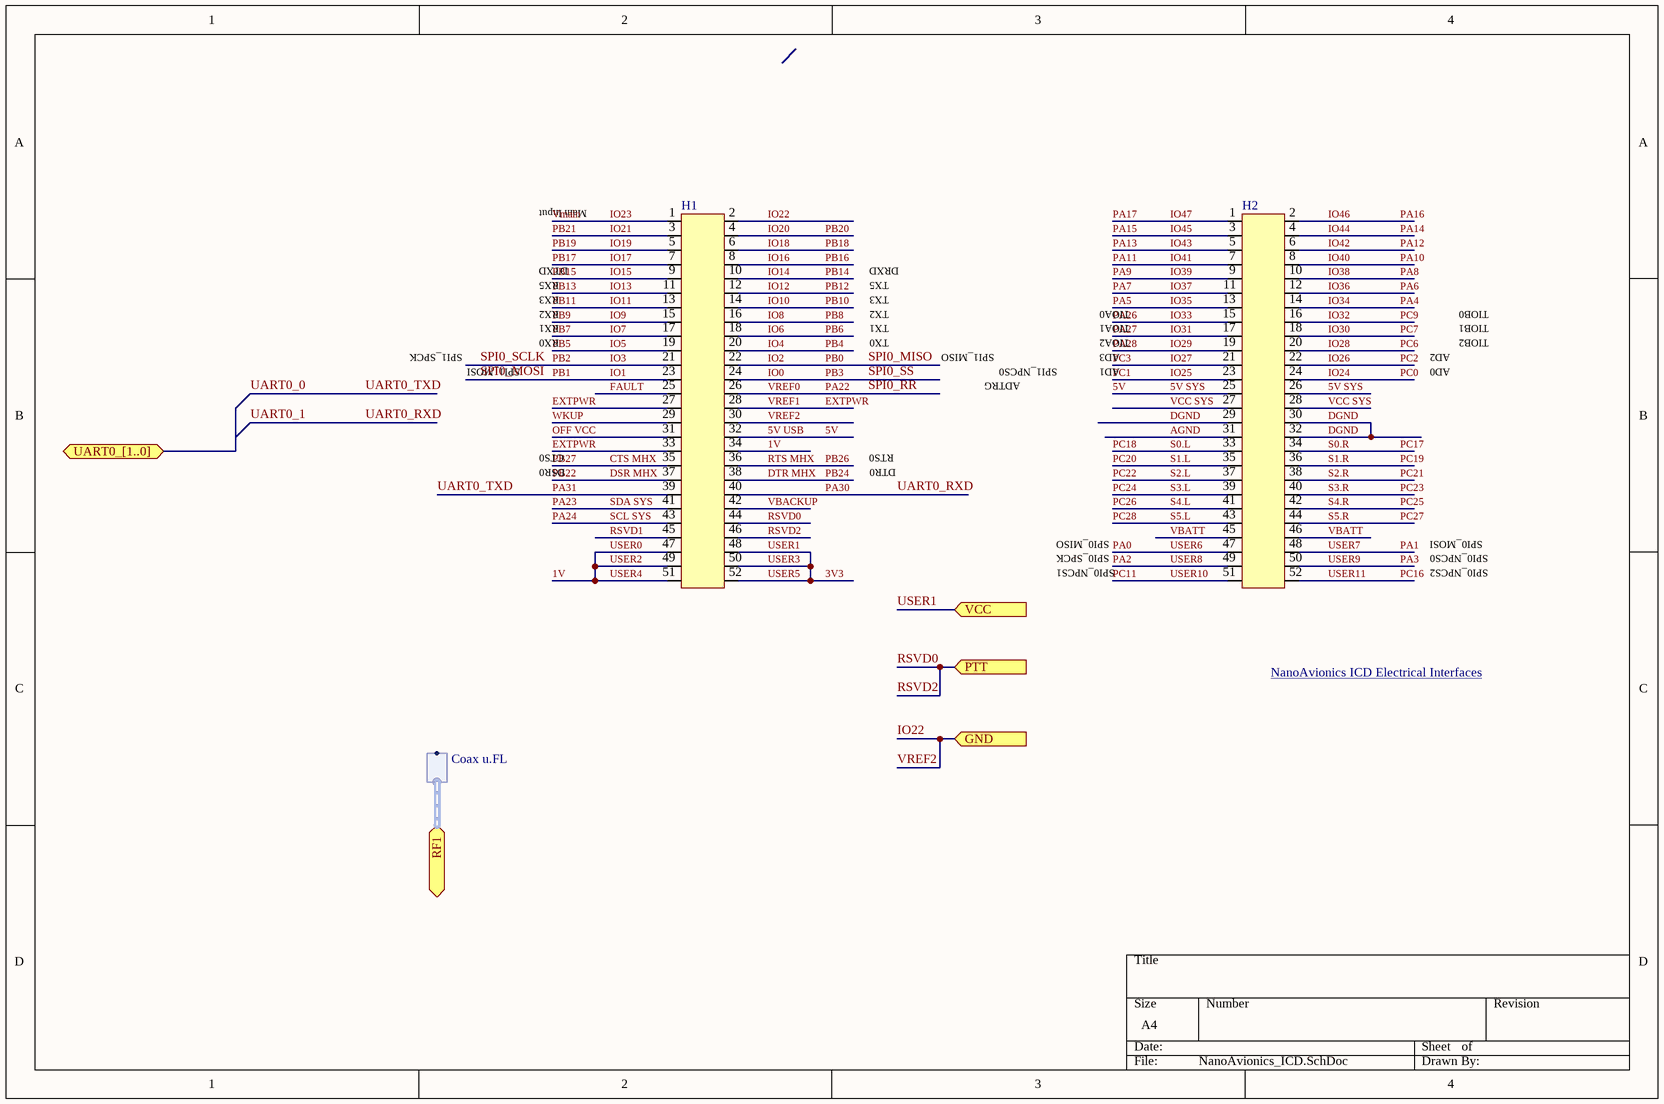
[diagram p7: NanoAvionics_ICD.SchDoc]

### Parts
(Parts that share a designator on the sheet are numbered #1, #2 ... from top to bottom, then left to right.)
H1#4  (no value)  [SAMTEC_ESQ_126_39_G_D]
H2#4  (no value)  [SAMTEC_ESQ_126_39_G_D]

### Ports
GND (in), PTT (in), RF1 (harness Coax u.FL), UART0_[1..0] (bidir), VCC (in)

### Harnesses
Coax u.FL: 

### Nets
IO22: H1#4.2 H1#4.30 ; port GND  [also labelled VREF2]  [project net Array-]
1V: H1#4.34 H1#4.47 H1#4.49 H1#4.51  [also labelled USER0, USER2, USER4]
3V3: H1#4.48 H1#4.50 H1#4.52 ; port VCC  [also labelled USER1, USER3, USER5]
5V: H1#4.32 H2#4.25 H2#4.26  [also labelled 5V SYS, 5V USB]
AGND: H2#4.31
CTS MHX: H1#4.35  [also labelled PB27]
DGND: H2#4.29 H2#4.30 H2#4.32
DSR MHX: H1#4.37  [also labelled PB22]
DTR MHX: H1#4.38  [also labelled PB24]
EXTPWR: H1#4.27 H1#4.28 H1#4.33  [also labelled VREF1]
FAULT: H1#4.25
IO0: H1#4.24  [also labelled PB3, SPI0_SS]
IO1: H1#4.23  [also labelled PB1, SPI0_MOSI]
IO2: H1#4.22  [also labelled PB0, SPI0_MISO]
IO3: H1#4.21  [also labelled PB2, SPI0_SCLK]
IO4: H1#4.20  [also labelled PB4]
IO5: H1#4.19  [also labelled PB5]
IO6: H1#4.18  [also labelled PB6]
IO7: H1#4.17  [also labelled PB7]
IO8: H1#4.16  [also labelled PB8]
IO9: H1#4.15  [also labelled PB9]
IO10: H1#4.14  [also labelled PB10]
IO11: H1#4.13  [also labelled PB11]
IO12: H1#4.12  [also labelled PB12]
IO13: H1#4.11  [also labelled PB13]
IO14: H1#4.10  [also labelled PB14]
IO15: H1#4.9  [also labelled PB15]
IO16: H1#4.8  [also labelled PB16]
IO17: H1#4.7  [also labelled PB17]
IO18: H1#4.6  [also labelled PB18]
IO19: H1#4.5  [also labelled PB19]
IO20: H1#4.4  [also labelled PB20]
IO21: H1#4.3  [also labelled PB21]
IO23: H1#4.1  [also labelled Vmain]
IO24: H2#4.24  [also labelled PC0]
IO25: H2#4.23  [also labelled PC1]
IO26: H2#4.22  [also labelled PC2]
IO27: H2#4.21  [also labelled PC3]
IO28: H2#4.20  [also labelled PC6]
IO29: H2#4.19  [also labelled PA28]
IO30: H2#4.18  [also labelled PC7]
IO31: H2#4.17  [also labelled PA27]
IO32: H2#4.16  [also labelled PC9]
IO33: H2#4.15  [also labelled PA26]
IO34: H2#4.14  [also labelled PA4]
IO35: H2#4.13  [also labelled PA5]
IO36: H2#4.12  [also labelled PA6]
IO37: H2#4.11  [also labelled PA7]
IO38: H2#4.10  [also labelled PA8]
IO39: H2#4.9  [also labelled PA9]
IO40: H2#4.8  [also labelled PA10]
IO41: H2#4.7  [also labelled PA11]
IO42: H2#4.6  [also labelled PA12]
IO43: H2#4.5  [also labelled PA13]
IO44: H2#4.4  [also labelled PA14]
IO45: H2#4.3  [also labelled PA15]
IO46: H2#4.2  [also labelled PA16]
IO47: H2#4.1  [also labelled PA17]
OFF VCC: H1#4.31
PA0: H2#4.47  [also labelled USER6]
PA1: H2#4.48  [also labelled USER7]
PA2: H2#4.49  [also labelled USER8]
PA3: H2#4.50  [also labelled USER9]
PA22: H1#4.26  [also labelled SPI0_RR, VREF0]
PA23: H1#4.41  [also labelled SDA SYS]
PA24: H1#4.43  [also labelled SCL SYS]
PA30: H1#4.40  [also labelled UART0_1, UART0_RXD]
PA31: H1#4.39  [also labelled UART0_0, UART0_TXD]
PB26: H1#4.36  [also labelled RTS MHX]
PC11: H2#4.51  [also labelled USER10]
PC16: H2#4.52  [also labelled USER11]
PC17: H2#4.34  [also labelled S0.R]
PC18: H2#4.33  [also labelled S0.L]
PC19: H2#4.36  [also labelled S1.R]
PC20: H2#4.35  [also labelled S1.L]
PC21: H2#4.38  [also labelled S2.R]
PC22: H2#4.37  [also labelled S2.L]
PC23: H2#4.40  [also labelled S3.R]
PC24: H2#4.39  [also labelled S3.L]
PC25: H2#4.42  [also labelled S4.R]
PC26: H2#4.41  [also labelled S4.L]
PC27: H2#4.44  [also labelled S5.R]
PC28: H2#4.43  [also labelled S5.L]
RSVD0: H1#4.44 H1#4.46 ; port PTT  [also labelled RSVD2]
RSVD1: H1#4.45
VBACKUP: H1#4.42
VBATT: H2#4.45 H2#4.46
VCC SYS: H2#4.27 H2#4.28
WKUP: H1#4.29

### Notes on the sheet
- Main Input
- RX1
- RX2
- RX3
- RX5
- DTXD
- TX1
- TX2
- TX3
- TX5
- DRXD
- TIOA0
- TIOA1
- TIOB0
- TIOB1
- SPI1_SPCK
- SPI1_MOSI
- RX0
- TX0
- SPI1_MISO
- ADTRG
- SPI1_NPCS0
- AD1
- AD3
- TIOA2
- AD0
- AD2
- TIOB2
- CTS0
- DSR0
- DTR0
- RTS0
- SPI0_MISO
- SPI0_MOSI
- SPI0_SPCK
- SPI0_NPCS1
- SPI0_NPCS0
- SPI0_NPCS2
- NanoAvionics ICD Electrical Interfaces <QB50_GAMANET_ICD_v2.0_20131128-1.pdf#nameddest=PC104Pins>

### Library data of the parts
H1#4 H2#4 = SAMTEC_ESQ_126_39_G_D: 26X2 header

## Nets that join several sheets
5V: power_board_2.SchDoc (H1#2.1 H2#2.25 H2#2.26 P.2), ACS.SchDoc (8 pins)
Array-: YUsendQB50-TopLevel (R1#1.2 R2#1.2), CubeSatHeaders-OBC (5 pins), power_board_2.SchDoc (14 pins), ACS.SchDoc (64 pins), U_TX (15 pins), U_BX (15 pins), U_BNX (15 pins), U_TY (15 pins), U_BY (15 pins), NanoAvionics_ICD (H1#4.2 H1#4.30)
Array+: power_board_2.SchDoc (P1.1 P1.2), U_TX (SC2_U_TX.Pos SC3_U_TX.Pos), U_BX (SC2_U_BX.Pos SC3_U_BX.Pos)
Array+: power_board_2.SchDoc (P2.1 P2.2), U_TNX (SC2_U_TNX.Pos SC3_U_TNX.Pos), U_BNX (SC2_U_BNX.Pos SC3_U_BNX.Pos)
Array+: power_board_2.SchDoc (P3.1 P3.2), U_TY (SC2_U_TY.Pos SC3_U_TY.Pos), U_BY (SC2_U_BY.Pos SC3_U_BY.Pos)
Array+: power_board_2.SchDoc (P4.1 P4.2), U_BNY (SC2_U_BNY.Pos SC3_U_BNY.Pos)
Array+: power_board_2.SchDoc (P5.1), QB50NZSolarArray (SC2.Pos SC3.Pos)
Array-: power_board_2.SchDoc (P2.3), U_TNX (15 pins)
Array-: power_board_2.SchDoc (P4.3 P4.4), U_BNY (15 pins)
Array-: power_board_2.SchDoc (P5.3), QB50NZSolarArray (13 pins)
ARRAYNX.5.VDD.VDD: power_board_2.SchDoc (9 pins), U_TX (C1_U_TX.2 R1_U_TX.2 R3_U_TX.2 U1_U_TX.12), U_BX (C1_U_BX.2 R1_U_BX.2 R3_U_BX.2 U1_U_BX.12), U_TNX (C1_U_TNX.2 R1_U_TNX.2 R3_U_TNX.2 U1_U_TNX.12), U_BNX (C1_U_BNX.2 R1_U_BNX.2 R3_U_BNX.2 U1_U_BNX.12), U_TY (C1_U_TY.2 R1_U_TY.2 R3_U_TY.2 U1_U_TY.12), U_BY (C1_U_BY.2 R1_U_BY.2 R3_U_BY.2 U1_U_BY.12), U_TNY (C1_U_TNY.2 R1_U_TNY.2 R3_U_TNY.2 U1_U_TNY.12), U_BNY (C1_U_BNY.2 R1_U_BNY.2 R3_U_BNY.2 U1_U_BNY.12), QB50NZSolarArray (C1.2 R1#2.2 R3.2 U1#2.12)
ARRAYNX.7.SDA.SDA: power_board_2.SchDoc (P1.7 P1.8 P2.7), U_TX (U1_U_TX.2), U_TNX (U1_U_TNX.2)
ARRAYNX.8.SDA.SDA: power_board_2.SchDoc (P2.8), U_BNX (U1_U_BNX.2)
ARRAYNX.10.SCL.SCL: power_board_2.SchDoc (P1.9 P1.10 P2.9 P2.10), U_TX (U1_U_TX.1), U_BX (U1_U_BX.1), U_BNX (U1_U_BNX.1)
ARRAYNY.7.SDA.SDA: power_board_2.SchDoc (P3.7 P3.8 P4.7 P4.8), U_TY (U1_U_TY.2), U_BY (U1_U_BY.2), U_TNY (U1_U_TNY.2), U_BNY (U1_U_BNY.2)
ARRAYNY.10.SCL.SCL: power_board_2.SchDoc (P3.9 P3.10 P4.9 P4.10), U_TY (U1_U_TY.1), U_BY (U1_U_BY.1), U_TNY (U1_U_TNY.1), U_BNY (U1_U_BNY.1)
ARRAYNZ.7.SDA.SDA: power_board_2.SchDoc (P5.7), QB50NZSolarArray (U1#2.2)
ARRAYNZ.8.NC.NC: YUsendQB50-TopLevel (S9.3 S10.3), power_board_2.SchDoc (H2#2.21 H2#2.45 H2#2.46 P5.8)
ARRAYNZ.9.SCL.SCL: power_board_2.SchDoc (P5.9), QB50NZSolarArray (U1#2.1)
ARRAYNZ.10.COM.COM: YUsendQB50-TopLevel (S3.2 S4.2), power_board_2.SchDoc (P5.10)
DRIVE-XA: YUsendQB50-TopLevel (L1#1.2), ACS.SchDoc (IC3.2 J1.1)
DRIVE-XB: YUsendQB50-TopLevel (L1#1.1), ACS.SchDoc (IC3.6 J1.2)
DRIVE-YA: YUsendQB50-TopLevel (L2#1.2), ACS.SchDoc (IC4.2 J2.1)
DRIVE-YB: YUsendQB50-TopLevel (L2#1.1), ACS.SchDoc (IC4.6 J2.2)
DRIVE-ZA: YUsendQB50-TopLevel (L3#1.2), ACS.SchDoc (IC5.2 J3#2.1)
DRIVE-ZB: YUsendQB50-TopLevel (L3#1.1), ACS.SchDoc (IC5.6 J3#2.2)
SWITCHES.3.NC.NC: YUsendQB50-TopLevel (S7.2 S8.3), power_board_2.SchDoc (P.3 P.7)